# Altium project Multi_Interface_Hub_Pro_v1.0.PrjPcb (part 1 of 3)
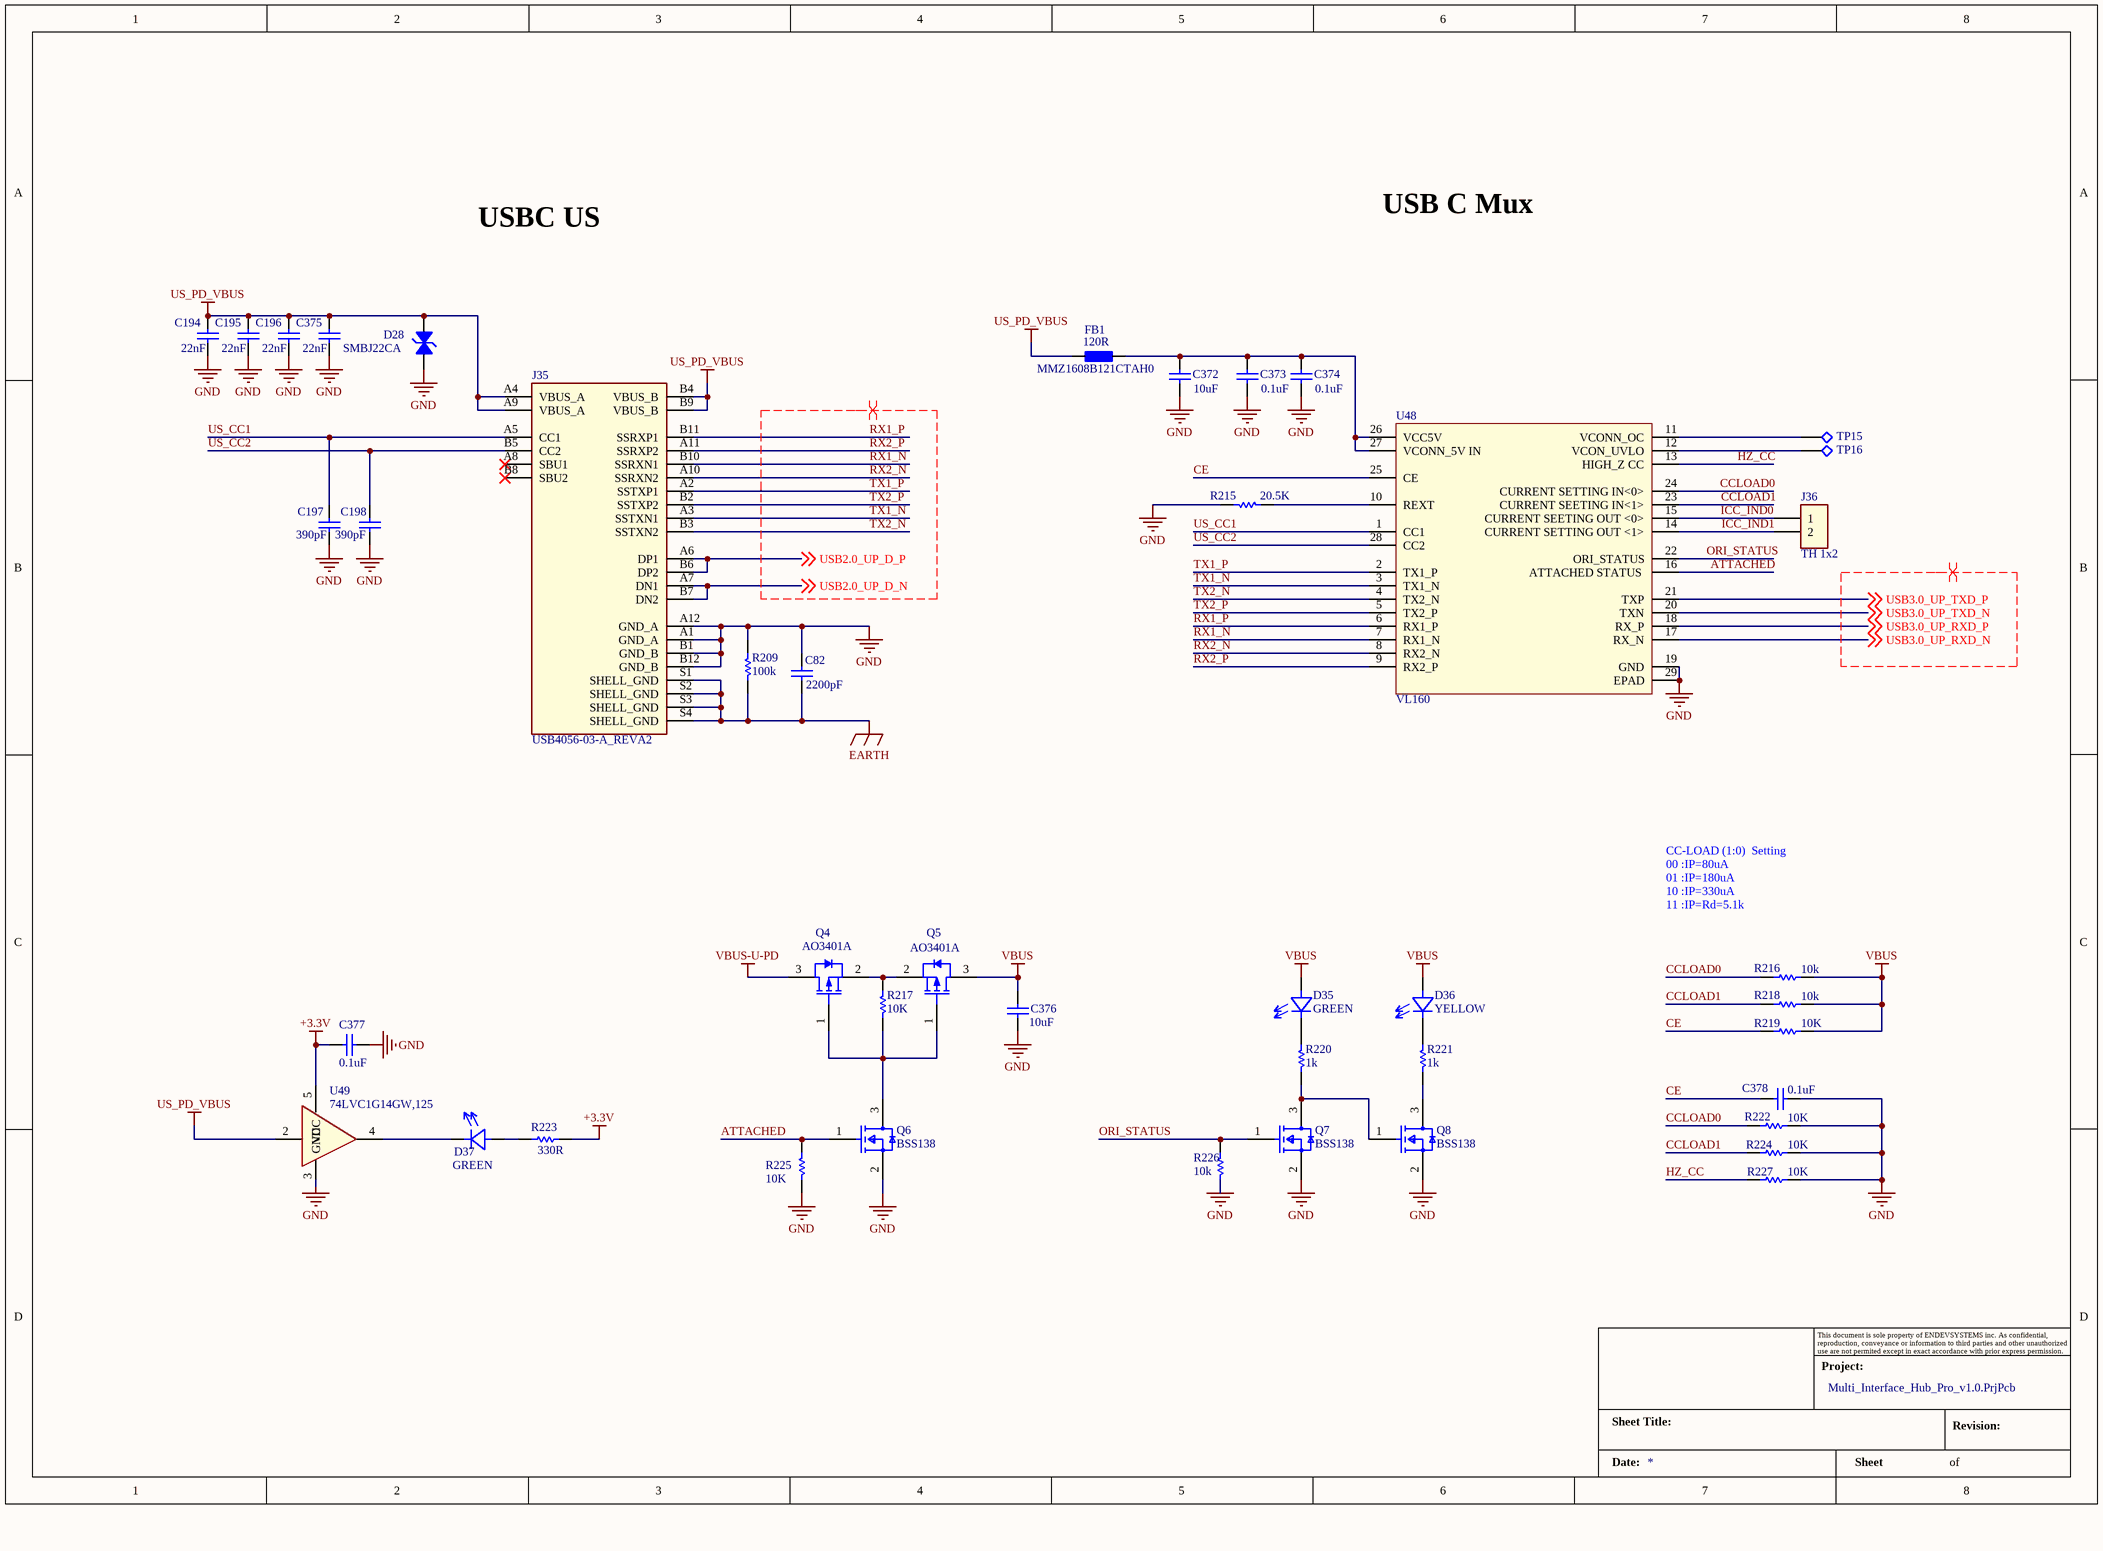
[diagram p0: USBC-US-Conn.SchDoc]
Revision: A
13 sheets, 788 parts. Net scope: global (net labels, ports and power ports of the same name join across sheets).
Board file: Multi_Interface_Hub_Pro_v1.0.PcbDoc
Sheets:
  USBC-US-Conn.SchDoc
  USBC-US-100W-PD.SchDoc
  USBC_Hub1.SchDoc
  USBC_Hub2.SchDoc
  USB2.0_Hub.SchDoc
  TypeA_3.1_Ports.SchDoc
  USBC_DS1_DS2.SchDoc
  USBC_DS3_DS4.SchDoc
  USBC-DS1-100W-PD.SchDoc
  PowerSwitch_DS2_DS3_DS4.SchDoc
  Gbe_Ethernet.SchDoc
  Audio_Codec.SchDoc
  InputPower.SchDoc

## Sheet USBC-US-Conn.SchDoc
size A3

### Parts
(Parts that share a designator on the sheet are numbered #1, #2 ... from top to bottom, then left to right.)
?#1  Project:: Multi_Interface_Hub_Pro_v1.0.PrjPcb  (hidden comment: Title_Block)  (graphical)
C82  2200pF  [C-0603/1608]
C194  22nF  [C-0805/2012]
C195  22nF  [C-0805/2012]
C196  22nF  [C-0805/2012]
C197  390pF  [C-0805/2012]
C198  390pF  [C-0805/2012]
C372  10uF  [C-0402/1005]
C373  0.1uF  [C-0402/1005]
C374  0.1uF  [C-0402/1005]
C375  22nF  [C-0805/2012]
C376  10uF  [C-0805/2012]
C377  0.1uF  [C-0402/1005]
C378  0.1uF  [C-0402/1005]
D28  SMBJ22CA  [DO-214AA\SMB]
D35  GREEN  [LEDC1608X65N]
D36  YELLOW  [LEDC1608X65N]
D37  GREEN  [LEDC1608X65N]
FB1  MMZ1608B121CTAH0  value 120R  [R-0603/1608]
J35  USB4056-03-A_REVA2  [GCT_USB4056-03-A_REVA2]
J36  TH 1x2  [PIN HEADER 1x2 2.54mm]
Q4  AO3401A  [AO-SOT-23-3L_V]
Q5  AO3401A  [AO-SOT-23-3L_V]
Q6  BSS138  [FP-318-08-IPC_B]
Q7  BSS138  [FP-318-08-IPC_B]
Q8  BSS138  [FP-318-08-IPC_B]
R209  100k  [R-0603/1608]
R215  20.5K  [R-0402/1005]
R216  10k  [R-0402/1005]
R217  10K  [R-0402/1005]
R218  10k  [R-0402/1005]
R219  10K  [R-0402/1005]
R220  1k  [R-0402/1005]
R221  1k  [R-0402/1005]
R222  10K  [R-0402/1005]
R223  330R  [R-0402/1005]
R224  10K  [R-0402/1005]
R225  10K  [R-0402/1005]
R226  10k  [R-0402/1005]
R227  10K  [R-0402/1005]
TP15  Test Points  [Test Point TH Round H0.9,D1.6]  (value not drawn)
TP16  Test Points  [Test Point TH Round H0.9,D1.6]  (value not drawn)
U48  VL160  [VL160]
U49  74LVC1G14GW,125  [SOT65P212X110-5N]

### Nets
+3.3V: C377.2 R223.2 U49.5(VCC)
EARTH: C82.1 J35.S1(SHELL_GND) J35.S2(SHELL_GND) J35.S3(SHELL_GND) J35.S4(SHELL_GND) R209.1
GND: C82.2 C194.1 C195.1 C196.1 C197.1 C198.1 C372.1 C373.1 C374.1 C375.1 C376.1 C377.1 C378.2 D28.1 J35.A1(GND_A) J35.A12(GND_A) J35.B1(GND_B) J35.B12(GND_B) Q6.2(S) Q7.2(S) Q8.2(S) R209.2 R215.1 R222.1 R224.1 R225.1 R226.1 R227.1 U48.19(GND) U48.29(EPAD) U49.3(GND)
US_PD_VBUS: C194.2 C195.2 C196.2 C375.2 D28.2 FB1.2 J35.A4(VBUS_A) J35.A9(VBUS_A) J35.B4(VBUS_B) J35.B9(VBUS_B) U49.2(A)
VBUS: C376.2 D35.A D36.A Q5.3(DRAIN) R216.1 R218.1 R219.1
VBUS-U-PD: Q4.3(DRAIN)
ATTACHED: Q6.1(G) R225.2 U48.16(ATTACHED_STATUS)
CCLOAD0: R216.2 R222.2 U48.24(CURRENT_SETTING_IN<0>)
CCLOAD1: R218.2 R224.2 U48.23(CURRENT_SEETING_IN<1>)
CE: C378.1 R219.2 U48.25(CE)
HZ_CC: R227.2 U48.13(HIGH_Z_CC)
ICC_IND0: J36.1 U48.15(CURRENT_SEETING_OUT_<0>)
ICC_IND1: J36.2 U48.14(CURRENT_SETTING_OUT_<1>)
ORI_STATUS: Q7.1(G) R226.2 U48.22(ORI_STATUS)
RX1_N: J35.B10(SSRXN1) U48.7(RX1_N)
RX1_P: J35.B11(SSRXP1) U48.6(RX1_P)
RX2_N: J35.A10(SSRXN2) U48.8(RX2_N)
RX2_P: J35.A11(SSRXP2) U48.9(RX2_P)
TX1_N: J35.A3(SSTXN1) U48.3(TX1_N)
TX1_P: J35.A2(SSTXP1) U48.2(TX1_P)
TX2_N: J35.B3(SSTXN2) U48.4(TX2_N)
TX2_P: J35.B2(SSTXP2) U48.5(TX2_P)
US_CC1: C197.2 J35.A5(CC1) U48.1(CC1)
US_CC2: C198.2 J35.B5(CC2) U48.28(CC2)
USB2.0_UP_D_N: J35.A7(DN1) J35.B7(DN2) ; off-sheet USB2.0_UP_D_N
USB2.0_UP_D_P: J35.A6(DP1) J35.B6(DP2) ; off-sheet USB2.0_UP_D_P
USB3.0_UP_RXD_N: U48.17(RX_N) ; off-sheet USB3.0_UP_RXD_N
USB3.0_UP_RXD_P: U48.18(RX_P) ; off-sheet USB3.0_UP_RXD_P
USB3.0_UP_TXD_N: U48.20(TXN) ; off-sheet USB3.0_UP_TXD_N
USB3.0_UP_TXD_P: U48.21(TXP) ; off-sheet USB3.0_UP_TXD_P
NetC372_2: C372.2 C373.2 C374.2 FB1.1 U48.26(VCC5V) U48.27(VCONN_5V_IN)
NetD35_C: D35.C R220.2
NetD36_C: D36.C R221.2
NetD37_A: D37.A R223.1
NetD37_C: D37.C U49.4(~{Y})
NetQ4_1: Q4.1(GATE) Q5.1(GATE) Q6.3(D) R217.1
NetQ4_2: Q4.2(SOURCE) Q5.2(SOURCE) R217.2
NetQ7_3: Q7.3(D) Q8.1(G) R220.1
NetQ8_3: Q8.3(D) R221.1
NetR215_2: R215.2 U48.10(REXT)
NetTP15_1: TP15.1 U48.11(VCONN_OC)
NetTP16_1: TP16.1 U48.12(VCON_UVLO)

Not connected (* = marked no-connect by the designer): J35 A8(SBU1)* B8(SBU2)*

### Layout directives
differential pair; differential pair class Diff_90R: RX1_N, RX1_P, RX2_N, RX2_P, TX1_N, TX1_P, TX2_N, TX2_P, USB2.0_UP_D_N, USB2.0_UP_D_P, USB3.0_UP_RXD_N, USB3.0_UP_RXD_P, USB3.0_UP_TXD_N, USB3.0_UP_TXD_P

### Notes on the sheet
- USBC US
- USB C Mux
- CC-LOAD (1:0)  Setting
  00 :IP=80uA
  01 :IP=180uA
  10 :IP=330uA
  11 :IP=Rd=5.1k
- (in symbol Title_Block) This document is sole property of ENDEVSYSTEMS inc. As confidential, reproduction, conveyance or information to third parties and other unauthorized use are not permited except in exact accordance with prior express permission.; Project:; Sheet Title:; Revision:; Date:; Sheet; of

### Library data of the parts
C82 C194-C198 C372 C375 C376 = Cap: Capacitor; Value: 0.1uF; Published: 8-Jun-2000; LatestRevisionDate: 17-Jul-2002; LatestRevisionNote: Re-released for DXP Platform.; PackageReference: RAD-0.3; Publisher: Altium Limited; PackageDescription: Radial Cap, Thru-Hole; 2 Leads; 0.3 in Pin Spacing
C373 C374 C377 C378 = Cap: Capacitor; Published: 8-Jun-2000; LatestRevisionDate: 17-Jul-2002; LatestRevisionNote: Re-released for DXP Platform.; PackageReference: RAD-0.3; Publisher: Altium Limited; PackageDescription: Radial Cap, Thru-Hole; 2 Leads; 0.3 in Pin Spacing; Value: 0.1uF
D28 = ACPDQC3V3T-HF: TVS DIODE 3.3V 9.8V 0402C; Unit Price (USD): 0.41; Mfr. Part No.: ACPDQC3V3T-HF; Supplier Part No.: 641-1635-1-ND; Supplier: Digikey Electronics
D35-D37 = Diode-LED: Supplier: Digikey Electronics
FB1 = BLM15H: FERRITE BEAD 120 OHM 0402 1LN; Mfr. Part No.: BLM15HB121SN1D; Unit Price (USD): 0.19; Supplier Part No.: 490-4000-1-ND; Supplier: Digikey Electronics
J35 = USB4056-03-A_REVA2: USB-C (USB TYPE-C) USB 3.2 Gen 2 (USB 3.1 Gen 2, Superspeed + (USB 3.1)) Receptacle Connector 24 Position Surface Mount, Right Angle; Through Hole; MF: Global Connector Technology; Package: None; Check_prices: https://www.snapeda.com/parts/USB4056-03-A/Global+Connector+Technology/view-part/?ref=eda; Value: *; Availability: In Stock; SnapEDA_Link: https://www.snapeda.com/parts/USB4056-03-A/Global+Connector+Technology/view-part/?ref=snap; MP: USB4056-03-A; Price: None
J36 = Header 1x2: CONN HEADER VERT 3POS 2.54MM; Mfr. Part No.: 75160-156-03LF; Value: 51R; Unit Price (USD): 0.74; Supplier Part No.: 609-75160-156-03LF-ND; Supplier: Digikey Electronics
Q4 Q5 = CMP-2000-05778-1: P-Channel MOSFET, 30 V, 4 A, -55 to 150 degC, 3-Pin SOT-23-3L, RoHS, Tape and Reel; Manufacturer: Alpha and Omega; Output Power (Max): NotRequiredW; Power Dissipation: 1.4W; Rad Hardened: No; Drain Efficiency: NotRequired%; Drain-Source On-Volt: 30V; Noise Figure: NotRequireddB; Frequency (Max): NotRequiredMHz; Number of  Elements: 1; Gate-Source Voltage (Max): ?12V; Drain Current (Max): 4A; Channel Mode: Enhancement; Drain-Source On-Res: 0.044ohm; Type: PowerMOSFET; Polarity: P; Package URL: http://www.aosmd.com/res/packaging_information/SOT-23-3L.pdf; Datasheet URL: http://www.aosmd.com/res/data_sheets/AO3401A.pdf; Package Type: SOT-23; Package Description: 3-Pin Small Outline Transistor, Body 2.95 x 1.6 mm, Pitch 0.95 mm; Mounting: SurfaceMount; Manufacturer URL: http://www.aosmd.com/; Continuous Drain Current: 4A; Package Reference: SOT-23-3L; Mounting Technology: SurfaceMount; Operating Temperature Classification: Military; Power Gain: NotRequireddB; Datasheet Version: Rev. 3, 03/2011; Operating Temp Range: -55Cto150C; Pin Count: 3
Q6-Q8 = CMP-07173-000101-1: MOSFET N-CH 50V 220MA SOT-23; Turn-Off Delay Time: 20ns; Element Configuration: Single; Rds On Max: 3.5R; Gate to Source Voltage (Vgs): 20V; Threshold Voltage: 1.3V; Number of Elements: 1; Power Dissipation: 360mW; Rise Time: 9ns; Turn-On Delay Time: 2.5ns; Input Capacitance: 27pF; On-State Resistance: 6R; Lead Free: Lead Free; Length: 2.92mm; Width: 1.3mm; Drain to Source Breakdown Voltage: 50V; Min Operating Temperature: -55°C; REACH SVHC: No SVHC; Packaging: Tape and Reel; Radiation Hardening: No; Height: 0.93mm; Drain to Source Voltage (Vdss): 50V; Current Rating: 220mA; Voltage Rating (DC): 50V; Weight: 0.03g; Continuous Drain Current (ID): 220mA; Number of Pins: 3; Nominal Vgs: 1.3V; Max Power Dissipation: 360mW; Fall Time: 9ns; Drain to Source Resistance: 3.5R; Contact Plating: Tin; Case/Package: SOT-23; Package Quantity: 1; Dual Supply Voltage: 50V; Mount: Surface Mount; Termination: SMD/SMT; Max Operating Temperature: 150°C
R209 R215 R220 R221 R223 = Res1: Resistor; Value: 10K; Published: 8-Jun-2000; LatestRevisionDate: 17-Jul-2002; LatestRevisionNote: Re-released for DXP Platform.; PackageReference: AXIAL-0.3; Publisher: Altium Limited; PackageDescription: Axial Device, Thru-Hole; 2 Leads; 0.3 in Pin Spacing
R216-R219 R222 R224-R227 = Res1: Resistor; Published: 8-Jun-2000; LatestRevisionDate: 17-Jul-2002; LatestRevisionNote: Re-released for DXP Platform.; PackageReference: AXIAL-0.3; Publisher: Altium Limited; PackageDescription: Axial Device, Thru-Hole; 2 Leads; 0.3 in Pin Spacing; Value: 10K
U49 = 74LVC1G14GW,125: Inverter Schmitt Trigger 1-Element CMOS 5-Pin TSSOP T/R; Price: None; Availability: Unavailable; MP: 74LVC1G14GW,125; Value: *; Package: None
?#1 = Title_Block: Date:: *

## Sheet USBC-US-100W-PD.SchDoc
size A3; SheetNumber: 1; SheetTotal: 4
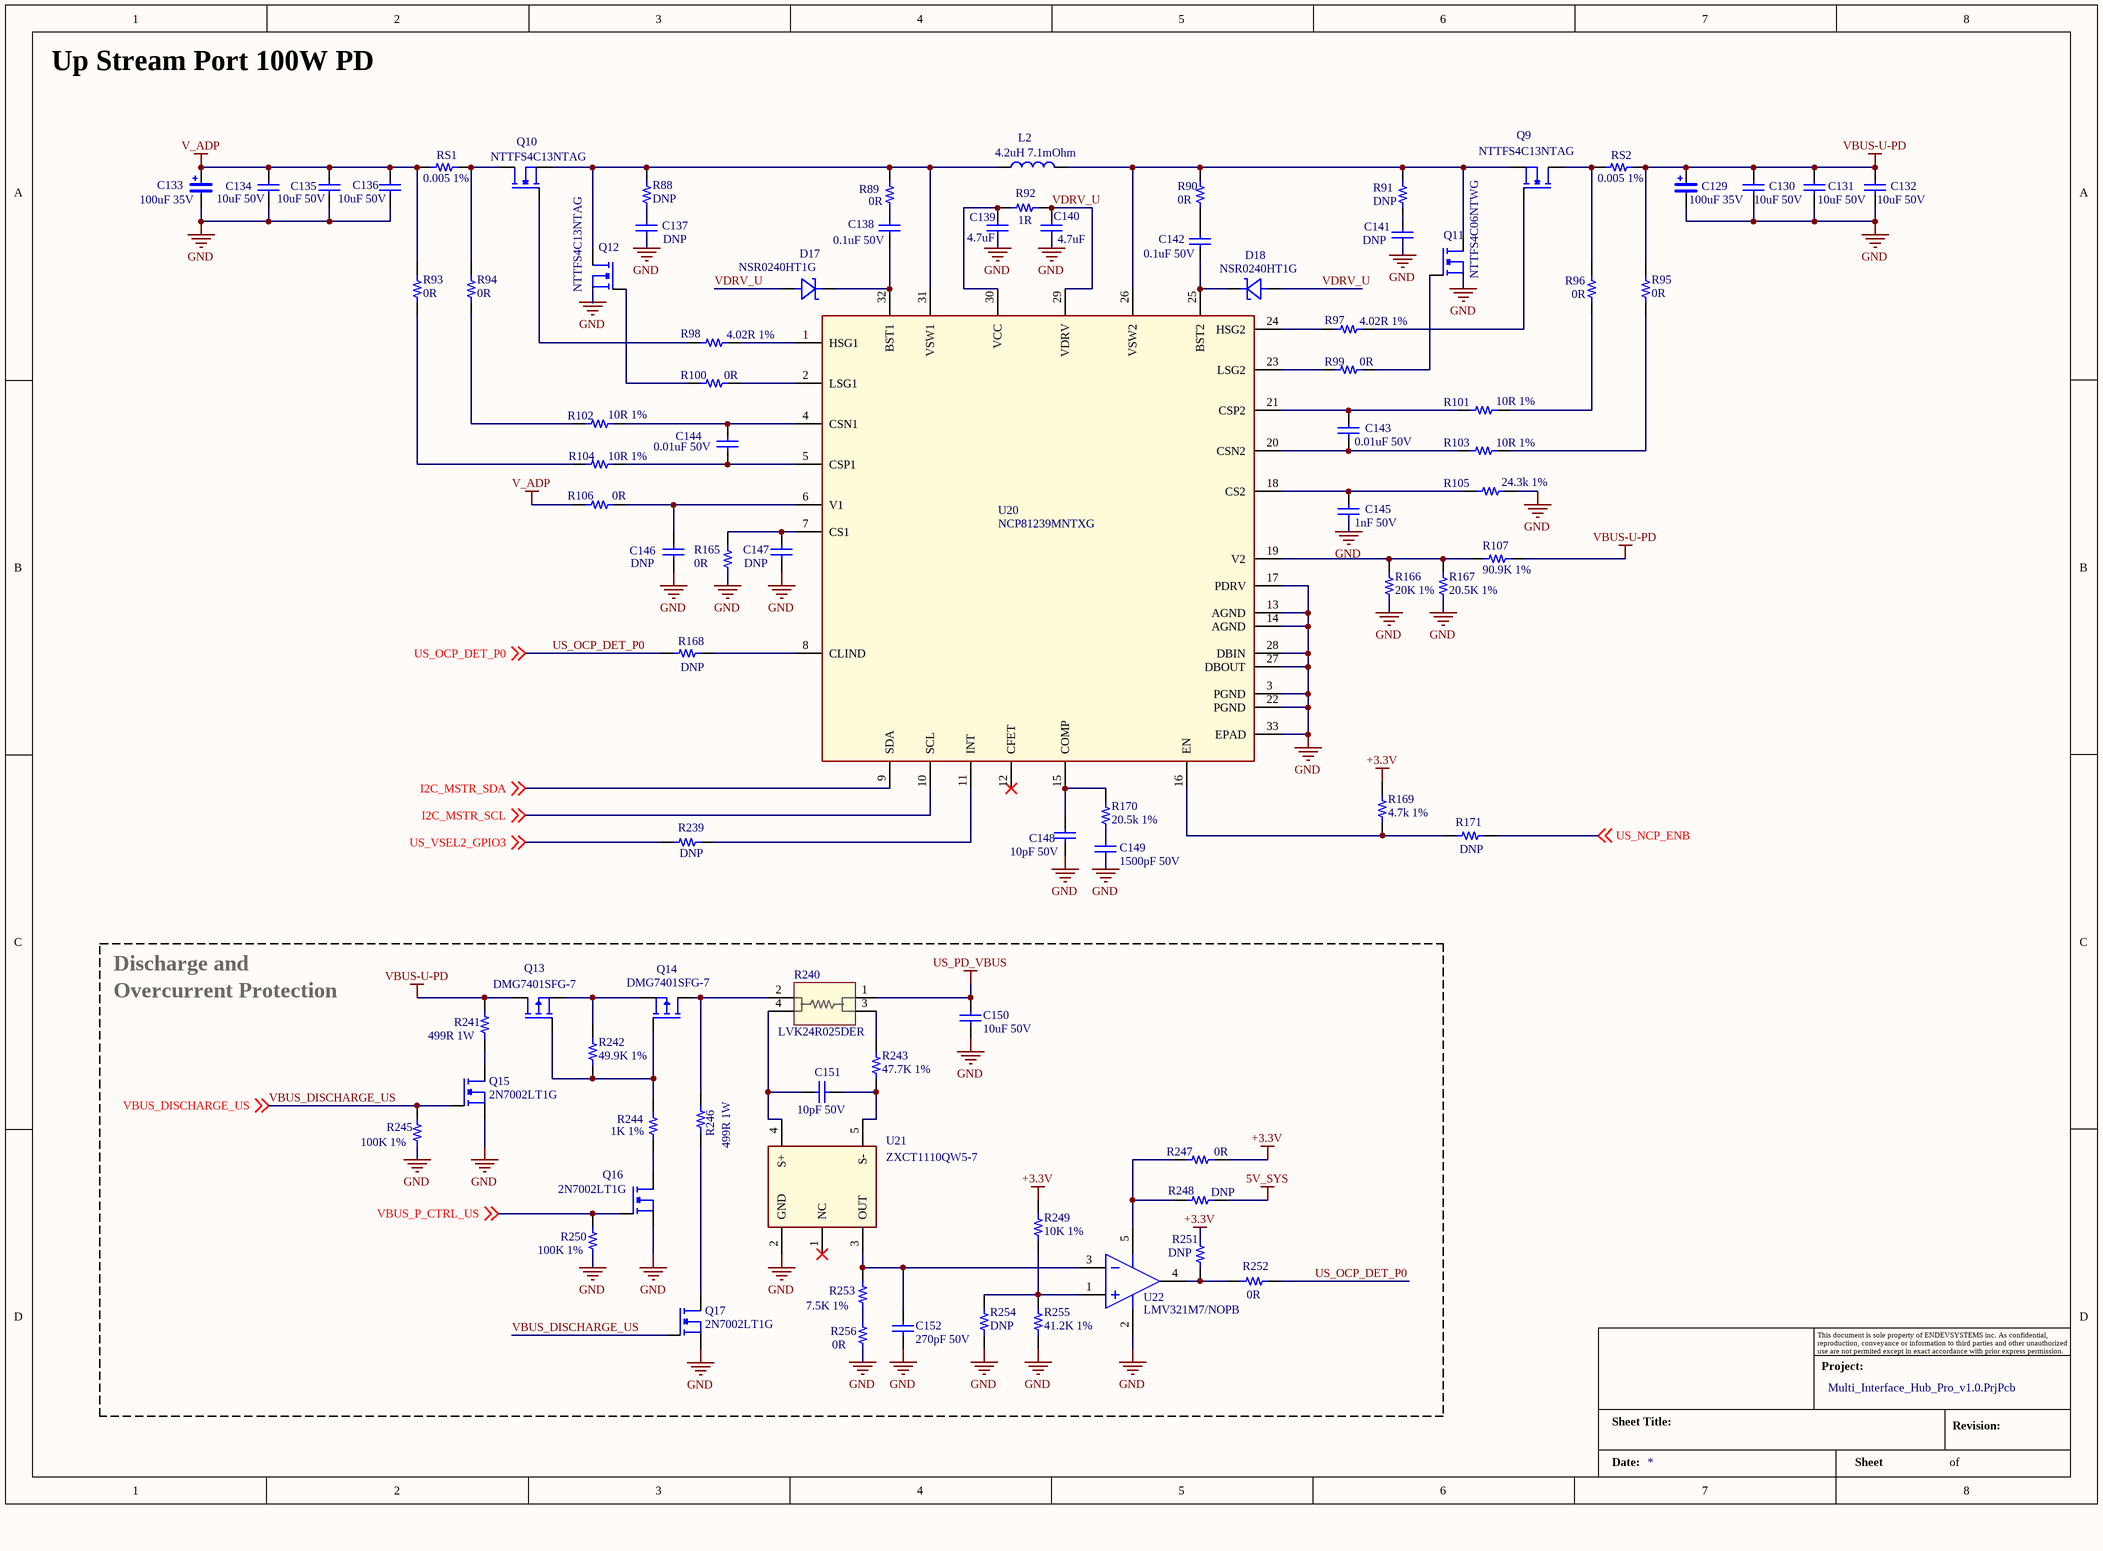
[diagram p1: USBC-US-100W-PD.SchDoc]

### Parts
(Parts that share a designator on the sheet are numbered #1, #2 ... from top to bottom, then left to right.)
?#2  Project:: Multi_Interface_Hub_Pro_v1.0.PrjPcb  (hidden comment: Title_Block)  (graphical)
C129  100uF 35V  [C-1206 (Tantalum)]
C130  10uF 50V  [C-0402/1005]
C131  10uF 50V  [C-0402/1005]
C132  10uF 50V  [C-0402/1005]
C133  100uF 35V  [C-1206 (Tantalum)]
C134  10uF 50V  [C-0402/1005]
C135  10uF 50V  [C-0402/1005]
C136  10uF 50V  [C-0402/1005]
C137  DNP  [C-0402/1005]
C138  0.1uF 50V  [C-0402/1005]
C139  4.7uF  [C-0402/1005]
C140  4.7uF  [C-0402/1005]
C141  DNP  [C-0402/1005]
C142  0.1uF 50V  [C-0402/1005]
C143  0.01uF 50V  [C-0402/1005]
C144  0.01uF 50V  [C-0402/1005]
C145  1nF 50V  [C-0402/1005]
C146  DNP  [C-0402/1005]
C147  DNP  [C-0402/1005]
C148  10pF 50V  [C-0402/1005]
C149  1500pF 50V  [C-0402/1005]
C150  value 10uF 50V  [C-0402/1005]  (hidden comment: 0.1uF)
C151  value 10pF 50V  [C-0402/1005]  (hidden comment: 0.1uF)
C152  value 270pF 50V  [C-0402/1005]  (hidden comment: 0.1uF)
D17  NSR0240HT1G  [SOIC-8 (W3.9mm) B]
D18  NSR0240HT1G  [SOIC-8 (W3.9mm) B]
L2  4.2uH 7.1mOhm  [4.3x4.3mm]
Q9  NTTFS4C13NTAG
Q10  NTTFS4C13NTAG
Q11  NTTFS4C06NTWG
Q12  NTTFS4C13NTAG
Q13  DMG7401SFG-7
Q14  DMG7401SFG-7
Q15  2N7002LT1G
Q16  2N7002LT1G
Q17  2N7002LT1G
R88  DNP  [R-0402]
R89  0R  [R-0402]
R90  0R  [R-0402]
R91  DNP  [R-0402]
R92  1R  [R-0402]
R93  0R  [R-0402]
R94  0R  [R-0402]
R95  0R  [R-0402]
R96  0R  [R-0402]
R97  4.02R 1%  [R-0402]
R98  4.02R 1%  [R-0402]
R99  0R  [R-0402]
R100  0R  [R-0402]
R101  10R 1%  [R-0402]
R102  10R 1%  [R-0402]
R103  10R 1%  [R-0402]
R104  10R 1%  [R-0402]
R105  24.3k 1%  [R-0402]
R106  0R  [R-0402]
R107  90.9K 1%  [R-0402]
R165  0R  [R-0402]
R166  20K 1%  [R-0402]
R167  20.5K 1%  [R-0402]
R168  DNP  [R-0402]
R169  4.7k 1%  [R-0402]
R170  20.5k 1%  [R-0402]
R171  DNP  [R-0402]
R239  DNP  [R-0402]
R240  LVK24R025DER  [LVK24_OHM]
R241  499R 1W  [R-0402]
R242  49.9K 1%  [R-0402]
R243  47.7K 1%  [R-0402]
R244  1K 1%  [R-0402]
R245  100K 1%  [R-0402]
R246  499R 1W  [R-0402]
R247  0R  [R-0402]
R248  DNP  [R-0402]
R249  10K 1%  [R-0402]
R250  100K 1%  [R-0402]
R251  DNP  [R-0402]
R252  0R  [R-0402]
R253  7.5K 1%  [R-0402]
R254  DNP  [R-0402]
R255  41.2K 1%  [R-0402]
R256  0R  [R-0402]
RS1  0.005 1%  [R-0402]
RS2  0.005 1%  [R-0402]
U20  NCP81239MNTXG  [QFN32_5X5_ONS]
U21  ZXCT1110QW5-7  [MSOP-10-W3mm]
U22  LMV321M7/NOPB  [DCK0005A_M]

### Nets
5V_SYS: R248.1
+3.3V: R169.1 R247.1 R249.2 R251.2
GND: C129.- C130.1 C131.1 C132.1 C133.- C134.1 C135.1 C136.1 C137.1 C139.1 C140.1 C141.1 C145.1 C146.1 C147.1 C148.1 C149.1 C150.2 C152.2 Q11.2(S) Q12.2(S) Q15.2(S) Q16.2(S) Q17.2(S) R105.2 R165.2 R166.2 R167.2 R245.1 R250.1 R254.1 R255.1 R256.1 U20.3(PGND) U20.13(AGND) U20.14(AGND) U20.17(PDRV) U20.22(PGND) U20.27(DBOUT) U20.28(DBIN) U20.33(EPAD) U21.2(GND) U22.2(V-)
US_PD_VBUS: C150.1 R240.1(E1)
V_ADP: C133.+ C134.2 C135.2 C136.2 R93.1 R106.2 RS1.1
VBUS-U-PD: C129.+ C130.2 C131.2 C132.2 Q13.3 R95.2 R107.2 R241.2 RS2.2
I2C_MSTR_SCL: U20.10(SCL) ; off-sheet I2C_MSTR_SCL
I2C_MSTR_SDA: U20.9(SDA) ; off-sheet I2C_MSTR_SDA
US_NCP_ENB: R171.2 ; off-sheet US_NCP_ENB
US_OCP_DET_P0: R168.2 R252.1 ; off-sheet US_OCP_DET_P0
US_VSEL2_GPIO3: R239.2 ; off-sheet US_VSEL2_GPIO3
VBUS_DISCHARGE_US: Q15.1(G) Q17.1(G) R245.2 ; off-sheet VBUS_DISCHARGE_US
VBUS_P_CTRL_US: Q16.1(G) R250.2 ; off-sheet VBUS_P_CTRL_US
VDRV_U: C140.2 D17.A D18.A R92.1 U20.29(VDRV)
NetC137_2: C137.2 R88.1
NetC138_1: C138.1 D17.C U20.32(BST1)
NetC138_2: C138.2 R89.1
NetC139_2: C139.2 R92.2 U20.30(VCC)
NetC141_2: C141.2 R91.1
NetC142_1: C142.1 D18.C U20.25(BST2)
NetC142_2: C142.2 R90.1
NetC143_1: C143.1 R103.2 U20.20(CSN2)
NetC143_2: C143.2 R101.2 U20.21(CSP2)
NetC144_1: C144.1 R104.1 U20.5(CSP1)
NetC144_2: C144.2 R102.1 U20.4(CSN1)
NetC145_2: C145.2 R105.1 U20.18(CS2)
NetC146_2: C146.2 R106.1 U20.6(V1)
NetC147_2: C147.2 R165.1 U20.7(CS1)
NetC148_2: C148.2 R170.1 U20.15(COMP)
NetC149_2: C149.2 R170.2
NetC151_1: C151.1 R243.1 U21.5(S-)
NetC151_2: C151.2 R240.4 U21.4(S+)
NetC152_1: C152.1 R253.2 U21.3(OUT) U22.3(IN-)
NetL2_1: L2.1 Q10.2(S) Q12.3(D) R88.2 R89.2 U20.31(VSW1)
NetL2_2: L2.2 Q9.2(S) Q11.3(D) R90.2 R91.2 U20.26(VSW2)
NetQ9_1: Q9.1(G) R97.1
NetQ9_3: Q9.3(D) R96.2 RS2.1
NetQ10_1: Q10.1(G) R98.2
NetQ10_3: Q10.3(D) R94.1 RS1.2
NetQ11_1: Q11.1(G) R99.1
NetQ12_1: Q12.1(G) R100.2
NetQ13_1: Q13.1 Q14.1 R242.1 R244.2
NetQ13_2: Q13.2 Q14.2 R242.2
NetQ14_3: Q14.3 R240.2(E2) R246.2
NetQ15_3: Q15.3(D) R241.1
NetQ16_3: Q16.3(D) R244.1
NetQ17_3: Q17.3(D) R246.1
NetR93_2: R93.2 R104.2
NetR94_2: R94.2 R102.2
NetR95_1: R95.1 R103.1
NetR96_1: R96.1 R101.1
NetR97_2: R97.2 U20.24(HSG2)
NetR98_1: R98.1 U20.1(HSG1)
NetR99_2: R99.2 U20.23(LSG2)
NetR100_1: R100.1 U20.2(LSG1)
NetR107_1: R107.1 R166.1 R167.1 U20.19(V2)
NetR168_1: R168.1 U20.8(CLIND)
NetR169_2: R169.2 R171.1 U20.16(EN)
NetR239_1: R239.1 U20.11(INT)
NetR240_3: R240.3 R243.2
NetR247_2: R247.2 R248.2 U22.5(V+)
NetR249_1: R249.1 R254.2 R255.2 U22.1(IN+)
NetR251_1: R251.1 R252.2 U22.4(OUT)
NetR253_1: R253.1 R256.2

Not connected (* = marked no-connect by the designer): U20 12(CFET)*; U21 1(NC)*

### Notes on the sheet
- Up Stream Port 100W PD
- Discharge and
- Overcurrent Protection
- (in symbol Title_Block) This document is sole property of ENDEVSYSTEMS inc. As confidential, reproduction, conveyance or information to third parties and other unauthorized use are not permited except in exact accordance with prior express permission.; Project:; Sheet Title:; Revision:; Date:; Sheet; of

### Library data of the parts
C129 C133 = Capacitor-Polar: CAP TANT 10UF 10% 16V 1206; Mfr. Part No.: F931C106KAAAJ6; Unit Price (USD): 0.67; Value: 10uF 16V; Supplier Part No.: 478-10723-1-ND; Supplier: Digikey Electronics
C130-C132 C134-C137 C139-C141 C143-C149 = Cap: Capacitor; Value: 0.1uF; Published: 8-Jun-2000; LatestRevisionDate: 17-Jul-2002; LatestRevisionNote: Re-released for DXP Platform.; PackageReference: RAD-0.3; Publisher: Altium Limited; PackageDescription: Radial Cap, Thru-Hole; 2 Leads; 0.3 in Pin Spacing
C138 C142 C150-C152 = Cap: Capacitor; Published: 8-Jun-2000; LatestRevisionDate: 17-Jul-2002; LatestRevisionNote: Re-released for DXP Platform.; PackageReference: RAD-0.3; Publisher: Altium Limited; PackageDescription: Radial Cap, Thru-Hole; 2 Leads; 0.3 in Pin Spacing
  C138 C142: Value: 0.1uF
D17 D18 = Diode-Schottky: Supplier: Digikey Electronics
L2 = 4.3x4.3mm: FIXED IND 22UH 620MA 350 MOHM; Mfr. Part No.: ASPI-4020S-220M-T; Unit Price (USD): 0.48; Supplier Part No.: 535-12307-1-ND; Value: 22uH; Supplier: Digikey Electronics
Q9-Q12 Q15-Q17 = MOSFET-N: Supplier: Digikey Electronics
Q13 Q14 = MOSFET-P: Supplier: Digikey Electronics
R88-R107 R165-R171 R239 R241-R256 RS1 RS2 = Resistor: RES SMD 51 OHM 0.5% 1/16W 0402; Mfr. Part No.: ERA-2AED510X; Value: 51R; Unit Price (USD): 0.21; Supplier Part No.: P51DECT-ND; Supplier: Digikey Electronics
R240 = LVK24R025DER: No Description Available; Mfr_Name: Ohmite; RefDes: RefDes; Type: Type
U20 = NCP81239MNTXG: No Description Available; Mfr_Name: onsemi; RefDes: RefDes; Type: Type
U21 = LT8607EMSE#PBF: IC REG BUCK ADJ 750MA 8DFN; Mfr. Part No.: LT8607EDC#TRMPBF; Unit Price (USD): 5.48; Supplier: Digikey Electronics; Supplier Part No.: LT8607EMSE#PBF-ND
U22 = CMP-0055-01046-3: General Purpose, Low Voltage, Rail-to-Rail Output Operational Amplifiers, 5-pin SC-70, Pb-Free; Manufacturer: Texas Instruments; PackageTopMarking: A12*XTT; PowerWise: N; CompType: Amplifiers; ComponentLink1Description: Datasheet URL; Code_JEITA: SC-88A; ComponentLink1URL: http://www.ti.com/general/docs/lit/getliterature.tsp?genericPartNumber=LMV321-N&fileType=pdf; Code_IPC: SOT353-5; PinCount: 5; RoHS: Y; Code_JEDEC: MO-203-AA; PackageDescription: Molded SC-70, 2 x 1.25 x .9mm, 5 Lead, 0.65mm Pitch; Package Reference: DCK0005A
?#2 = Title_Block: Date:: *

## Sheet USBC_Hub1.SchDoc
size A3; SheetNumber: 1; SheetTotal: 4
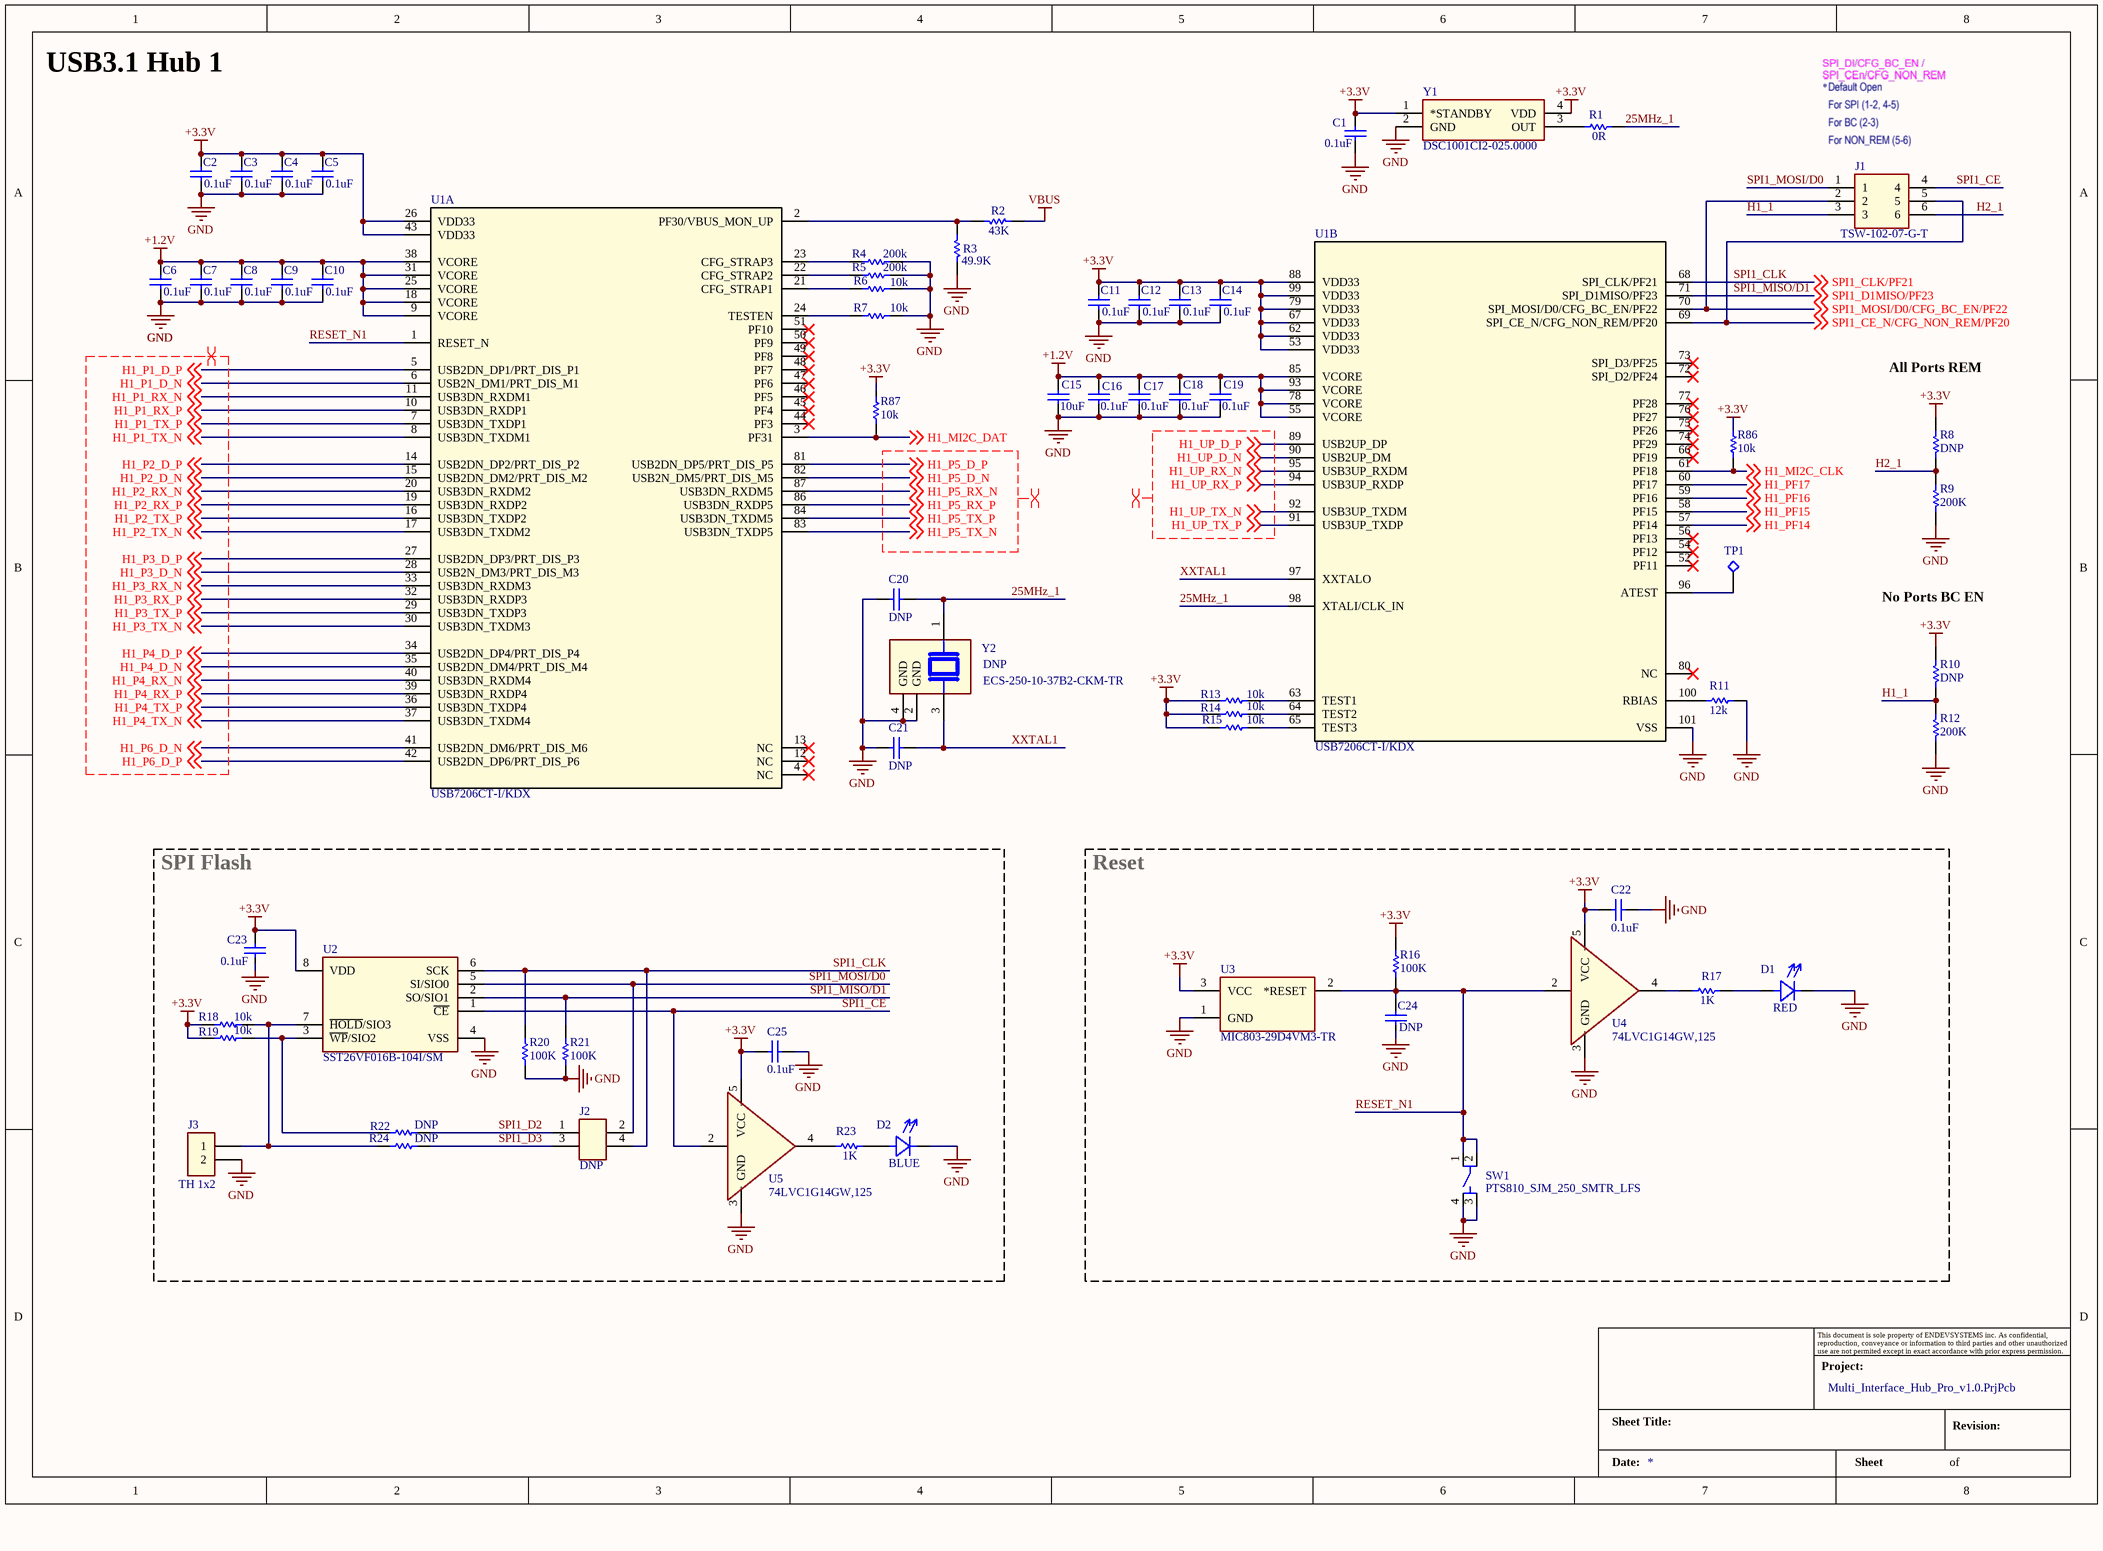
[diagram p2: USBC_Hub1.SchDoc]

### Parts
(Parts that share a designator on the sheet are numbered #1, #2 ... from top to bottom, then left to right.)
?#3  Project:: Multi_Interface_Hub_Pro_v1.0.PrjPcb  (hidden comment: Title_Block)  (graphical)
C1  0.1uF  [C-0402/1005]
C2  0.1uF  [C-0402/1005]
C3  0.1uF  [C-0402/1005]
C4  0.1uF  [C-0402/1005]
C5  0.1uF  [C-0402/1005]
C6  0.1uF  [C-0402/1005]
C7  0.1uF  [C-0402/1005]
C8  0.1uF  [C-0402/1005]
C9  0.1uF  [C-0402/1005]
C10  0.1uF  [C-0402/1005]
C11  0.1uF  [C-0402/1005]
C12  0.1uF  [C-0402/1005]
C13  0.1uF  [C-0402/1005]
C14  0.1uF  [C-0402/1005]
C15  10uF  [C-0805/2012]
C16  0.1uF  [C-0402/1005]
C17  0.1uF  [C-0402/1005]
C18  0.1uF  [C-0402/1005]
C19  0.1uF  [C-0402/1005]
C20  DNP  [R-0402/1005]
C21  DNP  [R-0402/1005]
C22  0.1uF  [C-0402/1005]
C23  0.1uF  [C-0402/1005]
C24  value DNP  [C-0402/1005]  (hidden comment: 0.1uF)
C25  0.1uF  [C-0402/1005]
D1  RED  [LEDC1608X65N]
D2  BLUE  [LEDC1608X65N]
J1  TSW-102-07-G-T  [CON6_3X2_TU_TSW_SAI]
J2  DNP  [PIN HEADER 2x2 2.54mm]
J3  TH 1x2  [PIN HEADER 1x2 2.54mm]
R1  0R  [R-0402/1005]
R2  43K  [R-0402/1005]
R3  49.9K  [R-0402/1005]
R4  200k  [R-0402/1005]
R5  200k  [R-0402/1005]
R6  10k  [R-0402/1005]
R7  10k  [R-0402/1005]
R8  DNP  [R-0402/1005]
R9  200K  [R-0402/1005]
R10  DNP  [R-0402/1005]
R11  12k  [R-0402/1005]
R12  200K  [R-0402/1005]
R13  10k  [R-0402/1005]
R14  10k  [R-0402/1005]
R15  10k  [R-0402/1005]
R16  100K  [R-0402/1005]
R17  1K  [R-0402/1005]
R18  10k  [R-0402/1005]
R19  10k  [R-0402/1005]
R20  100K  [R-0402/1005]
R21  100K  [R-0402/1005]
R22  DNP  [R-0402/1005]
R23  1K  [R-0402/1005]
R24  DNP  [R-0402/1005]
R86  10k  [R-0402/1005]
R87  10k  [R-0402/1005]
SW1  PTS810_SJM_250_SMTR_LFS  [SW_PTS810_SJM_250_SMTR_LFS]
TP1  Test Points  [Test Point TH Round H0.9,D1.6]  (value not drawn)
U1  USB7206CT-I/KDX  [USB7206]  (parts A,B of 2)
U2  SST26VF016B-104I/SM  [SOIC127P794X203-8N]
U3  MIC803-29D4VM3-TR  [SOT-23_M3_MCH]
U4  74LVC1G14GW,125  [SOT65P212X110-5N]
U5  74LVC1G14GW,125  [SOT65P212X110-5N]
Y1  DSC1001CI2-025.0000  [CDFN4_3P2X2P5_MCH]
Y2  DNP  [ECS-250-10-37B2]

### Blocks framed on the sheet
SPI Flash: C23 C25 D2 J2 J3 R18-R24 U2 U5
Reset: C22 C24 D1 R16 R17 SW1 U3 U4

### Nets
+1.2V: C6.2 C7.2 C8.2 C9.2 C10.2 C15.2 C16.1 C17.1 C18.2 C19.2 U1.9(VCORE) U1.18(VCORE) U1.25(VCORE) U1.31(VCORE) U1.38(VCORE) U1.55(VCORE) U1.78(VCORE) U1.85(VCORE) U1.93(VCORE)
+3.3V: C1.2 C2.2 C3.2 C4.2 C5.2 C11.2 C12.2 C13.2 C14.2 C22.2 C23.2 C25.2 R8.2 R10.2 R13.2 R14.2 R15.2 R16.1 R18.2 R19.2 R86.1 R87.1 U1.26(VDD33) U1.43(VDD33) U1.53(VDD33) U1.62(VDD33) U1.67(VDD33) U1.79(VDD33) U1.88(VDD33) U1.99(VDD33) U2.8(VDD) U3.3(VCC) U4.5(VCC) U5.5(VCC) Y1.1(*STANDBY) Y1.4(VDD)
GND: C1.1 C2.1 C3.1 C4.1 C5.1 C6.1 C7.1 C8.1 C9.1 C10.1 C11.1 C12.1 C13.1 C14.1 C15.1 C16.2 C17.2 C18.1 C19.1 C20.2 C21.2 C22.1 C23.1 C24.1 C25.1 D1.C D2.C J3.2 R3.2 R4.2 R5.2 R6.2 R7.1 R9.1 R11.1 R12.1 R20.2 R21.2 SW1.3 SW1.4 U1.101(VSS) U2.4(VSS) U3.1(GND) U4.3(GND) U5.3(GND) Y1.2(GND) Y2.2(GND) Y2.4(GND)
VBUS: R2.2
25MHz_1: C20.1 R1.2 U1.98(XTALI/CLK_IN) Y2.1
H1_1: J1.3 R10.1 R12.2
H1_MI2C_CLK: R86.2 U1.61(PF18) ; off-sheet H1_MI2C_CLK
H1_MI2C_DAT: R87.2 U1.3(PF31) ; off-sheet H1_MI2C_DAT
H1_P1_D_N: U1.6(USB2N_DM1/PRT_DIS_M1) ; off-sheet H1_P1_D_N
H1_P1_D_P: U1.5(USB2DN_DP1/PRT_DIS_P1) ; off-sheet H1_P1_D_P
H1_P1_RX_N: U1.11(USB3DN_RXDM1) ; off-sheet H1_P1_RX_N
H1_P1_RX_P: U1.10(USB3DN_RXDP1) ; off-sheet H1_P1_RX_P
H1_P1_TX_N: U1.8(USB3DN_TXDM1) ; off-sheet H1_P1_TX_N
H1_P1_TX_P: U1.7(USB3DN_TXDP1) ; off-sheet H1_P1_TX_P
H1_P2_D_N: U1.15(USB2DN_DM2/PRT_DIS_M2) ; off-sheet H1_P2_D_N
H1_P2_D_P: U1.14(USB2DN_DP2/PRT_DIS_P2) ; off-sheet H1_P2_D_P
H1_P2_RX_N: U1.20(USB3DN_RXDM2) ; off-sheet H1_P2_RX_N
H1_P2_RX_P: U1.19(USB3DN_RXDP2) ; off-sheet H1_P2_RX_P
H1_P2_TX_N: U1.17(USB3DN_TXDM2) ; off-sheet H1_P2_TX_N
H1_P2_TX_P: U1.16(USB3DN_TXDP2) ; off-sheet H1_P2_TX_P
H1_P3_D_N: U1.28(USB2N_DM3/PRT_DIS_M3) ; off-sheet H1_P3_D_N
H1_P3_D_P: U1.27(USB2DN_DP3/PRT_DIS_P3) ; off-sheet H1_P3_D_P
H1_P3_RX_N: U1.33(USB3DN_RXDM3) ; off-sheet H1_P3_RX_N
H1_P3_RX_P: U1.32(USB3DN_RXDP3) ; off-sheet H1_P3_RX_P
H1_P3_TX_N: U1.30(USB3DN_TXDM3) ; off-sheet H1_P3_TX_N
H1_P3_TX_P: U1.29(USB3DN_TXDP3) ; off-sheet H1_P3_TX_P
H1_P4_D_N: U1.35(USB2DN_DM4/PRT_DIS_M4) ; off-sheet H1_P4_D_N
H1_P4_D_P: U1.34(USB2DN_DP4/PRT_DIS_P4) ; off-sheet H1_P4_D_P
H1_P4_RX_N: U1.40(USB3DN_RXDM4) ; off-sheet H1_P4_RX_N
H1_P4_RX_P: U1.39(USB3DN_RXDP4) ; off-sheet H1_P4_RX_P
H1_P4_TX_N: U1.37(USB3DN_TXDM4) ; off-sheet H1_P4_TX_N
H1_P4_TX_P: U1.36(USB3DN_TXDP4) ; off-sheet H1_P4_TX_P
H1_P5_D_N: U1.82(USB2N_DM5/PRT_DIS_M5) ; off-sheet H1_P5_D_N
H1_P5_D_P: U1.81(USB2DN_DP5/PRT_DIS_P5) ; off-sheet H1_P5_D_P
H1_P5_RX_N: U1.87(USB3DN_RXDM5) ; off-sheet H1_P5_RX_N
H1_P5_RX_P: U1.86(USB3DN_RXDP5) ; off-sheet H1_P5_RX_P
H1_P5_TX_N: U1.83(USB3DN_TXDP5) ; off-sheet H1_P5_TX_N
H1_P5_TX_P: U1.84(USB3DN_TXDM5) ; off-sheet H1_P5_TX_P
H1_P6_D_N: U1.41(USB2DN_DM6/PRT_DIS_M6) ; off-sheet H1_P6_D_N
H1_P6_D_P: U1.42(USB2DN_DP6/PRT_DIS_P6) ; off-sheet H1_P6_D_P
H1_PF14: U1.57(PF14) ; off-sheet H1_PF14
H1_PF15: U1.58(PF15) ; off-sheet H1_PF15
H1_PF16: U1.59(PF16) ; off-sheet H1_PF16
H1_PF17: U1.60(PF17) ; off-sheet H1_PF17
H1_UP_D_N: U1.90(USB2UP_DM) ; off-sheet H1_UP_D_N
H1_UP_D_P: U1.89(USB2UP_DP) ; off-sheet H1_UP_D_P
H1_UP_RX_N: U1.95(USB3UP_RXDM) ; off-sheet H1_UP_RX_N
H1_UP_RX_P: U1.94(USB3UP_RXDP) ; off-sheet H1_UP_RX_P
H1_UP_TX_N: U1.92(USB3UP_TXDM) ; off-sheet H1_UP_TX_N
H1_UP_TX_P: U1.91(USB3UP_TXDP) ; off-sheet H1_UP_TX_P
H2_1: J1.6 R8.1 R9.2
RESET_N1: C24.2 R16.2 SW1.1 SW1.2 U1.1(RESET_N) U3.2(*RESET) U4.2(A)
SPI1_CE: J1.4 U2.1(~{CE}) U5.2(A)
SPI1_CE_N/CFG_NON_REM/PF20: J1.5 U1.69(SPI_CE_N/CFG_NON_REM/PF20) ; off-sheet SPI1_CE_N/CFG_NON_REM/PF20
SPI1_CLK: J2.4 R20.1 U1.68(SPI_CLK/PF21) U2.6(SCK) ; off-sheet SPI1_CLK/PF21  [also labelled SPI1_CLK/PF21]
SPI1_D2: J2.1 R22.2
SPI1_D3: J2.3 R24.2
SPI1_MISO/D1: R21.1 U1.71(SPI_D1MISO/PF23) U2.2(SO/SIO1) ; off-sheet SPI1_D1MISO/PF23  [also labelled SPI1_D1MISO/PF23]
SPI1_MOSI/D0: J1.1 J2.2 U2.5(SI/SIO0)
SPI1_MOSI/D0/CFG_BC_EN/PF22: J1.2 U1.70(SPI_MOSI/D0/CFG_BC_EN/PF22) ; off-sheet SPI1_MOSI/D0/CFG_BC_EN/PF22
XXTAL1: C21.1 U1.97(XXTALO) Y2.3
NetD1_A: D1.A R17.1
NetD2_A: D2.A R23.1
NetJ3_1: J3.1 R18.1 R24.1 U2.7(~{HOLD}/SIO3)
NetR1_1: R1.1 Y1.3(OUT)
NetR2_1: R2.1 R3.1 U1.2(PF30/VBUS_MON_UP)
NetR4_1: R4.1 U1.23(CFG_STRAP3)
NetR5_1: R5.1 U1.22(CFG_STRAP2)
NetR6_1: R6.1 U1.21(CFG_STRAP1)
NetR7_2: R7.2 U1.24(TESTEN)
NetR11_2: R11.2 U1.100(RBIAS)
NetR13_1: R13.1 U1.63(TEST1)
NetR14_1: R14.1 U1.64(TEST2)
NetR15_1: R15.1 U1.65(TEST3)
NetR17_2: R17.2 U4.4(~{Y})
NetR19_1: R19.1 R22.1 U2.3(~{WP}/SIO2)
NetR23_2: R23.2 U5.4(~{Y})
NetTP1_1: TP1.1 U1.96(ATEST)

Not connected (* = marked no-connect by the designer): U1 4(NC)* 12(NC)* 13(NC)* 44(PF3)* 45(PF4)* 46(PF5)* 47(PF6)* 48(PF7)* 49(PF8)* 50(PF9)* 51(PF10)* 52(PF11)* 54(PF12)* 56(PF13)* 66(PF19)* 72(SPI_D2/PF24)* 73(SPI_D3/PF25)* 74(PF29)* 75(PF26)* 76(PF27)* 77(PF28)* 80(NC)*

### Layout directives
differential pair; differential pair class Diff_90R: H1_P1_D_N, H1_P1_D_P, H1_P1_RX_N, H1_P1_RX_P, H1_P1_TX_N, H1_P1_TX_P, H1_P2_D_N, H1_P2_D_P, H1_P2_RX_N, H1_P2_RX_P, H1_P2_TX_N, H1_P2_TX_P, H1_P3_D_N, H1_P3_D_P, H1_P3_RX_N, H1_P3_RX_P, H1_P3_TX_N, H1_P3_TX_P, H1_P4_D_N, H1_P4_D_P, H1_P4_RX_N, H1_P4_RX_P, H1_P4_TX_N, H1_P4_TX_P, H1_P5_D_N, H1_P5_D_P, H1_P5_RX_N, H1_P5_RX_P, H1_P5_TX_N, H1_P5_TX_P, H1_P6_D_N, H1_P6_D_P, H1_UP_D_N, H1_UP_D_P, H1_UP_RX_N, H1_UP_RX_P, H1_UP_TX_N, H1_UP_TX_P

### Notes on the sheet
- USB3.1 Hub 1
- All Ports REM
- No Ports BC EN
- (in symbol Title_Block) This document is sole property of ENDEVSYSTEMS inc. As confidential, reproduction, conveyance or information to third parties and other unauthorized use are not permited except in exact accordance with prior express permission.; Project:; Sheet Title:; Revision:; Date:; Sheet; of

### Library data of the parts
C1-C19 C22-C25 = Cap: Capacitor; Published: 8-Jun-2000; LatestRevisionDate: 17-Jul-2002; LatestRevisionNote: Re-released for DXP Platform.; PackageReference: RAD-0.3; Publisher: Altium Limited; PackageDescription: Radial Cap, Thru-Hole; 2 Leads; 0.3 in Pin Spacing
  C1-C14 C16-C19 C22 C23 C25: Value: 0.1uF
  C15: Value: 10uF
C20 C21 = Cap: Capacitor; Value: 0.1uF; Published: 8-Jun-2000; LatestRevisionDate: 17-Jul-2002; LatestRevisionNote: Re-released for DXP Platform.; PackageReference: RAD-0.3; Publisher: Altium Limited; PackageDescription: Radial Cap, Thru-Hole; 2 Leads; 0.3 in Pin Spacing
D1 D2 = Diode-LED: Supplier: Digikey Electronics
J1 = TSW-102-07-G-T: No Description Available; Mfr_Name: Samtec Inc; Copyright: Copyright (C) 2023 Ultra Librarian. All rights reserved.; Manufacturer_Part_Number: TSW-102-07-G-T; Digi-Key_Part_Number_1: TSW-102-07-G-T-ND; RefDes: RefDes; Type: DEV
J2 = Header 2x2: FIXED IND 22UH 620MA 350 MOHM; Mfr. Part No.: PH2-04-UA; Unit Price (USD): 0.1; Supplier Part No.: 2057-PH2-04-UA-ND; Supplier: Digikey Electronics
J3 = Header 1x2: as J36 on sheet USBC-US-Conn; Supplier Part No.: 609-75160-156-03LF-ND; Supplier: Digikey Electronics
R1 R22 R24 = Res1: Resistor; Value: 200K; Published: 8-Jun-2000; LatestRevisionDate: 17-Jul-2002; LatestRevisionNote: Re-released for DXP Platform.; PackageReference: AXIAL-0.3; Publisher: Altium Limited; PackageDescription: Axial Device, Thru-Hole; 2 Leads; 0.3 in Pin Spacing
R2 R3 R8-R12 R16 R17 R20 R21 R23 = Res1: Resistor; Value: 10K; Published: 8-Jun-2000; LatestRevisionDate: 17-Jul-2002; LatestRevisionNote: Re-released for DXP Platform.; PackageReference: AXIAL-0.3; Publisher: Altium Limited; PackageDescription: Axial Device, Thru-Hole; 2 Leads; 0.3 in Pin Spacing
R4-R7 R13-R15 R18 R19 R86 R87 = Res1: Resistor; Published: 8-Jun-2000; LatestRevisionDate: 17-Jul-2002; LatestRevisionNote: Re-released for DXP Platform.; PackageReference: AXIAL-0.3; Publisher: Altium Limited; PackageDescription: Axial Device, Thru-Hole; 2 Leads; 0.3 in Pin Spacing
  R4 R5: Value: 200K
  R6 R7 R13-R15 R18 R19 R86 R87: Value: 10K
SW1 = PTS810_SJM_250_SMTR_LFS: Tactile Switch SPST-NO Top Actuated Surface Mount; MF: C&K; MP: PTS810 SJM 250 SMTR LFS; Price: None; Package: None; Availability: Unavailable; Value: *; SnapEDA_Link: https://www.snapeda.com/parts/PTS810%20SJM%20250%20SMTR%20LFS/C%26K/view-part/522770/?ref=snap
U1 = USB7206: IC USB3.1 GEN2 HUB TYPE C; Manufacturer: Microchip Technology; Manufacturer Product Number: USB7206CT-I/KDX; Digi-Key Part Number: 150-USB7206CT-I/KDXTR-ND; Unit Price: $12.9; Stock: 4935
U3 = MIC803-29D4VM3-TR: No Description Available; Mfr_Name: Microchip; Copyright: Copyright (C) 2023 Ultra Librarian. All rights reserved.; Manufacturer_Part_Number: MIC803-29D4VM3-TR; Digi-Key_Part_Number_1: 576-3806-1-ND; Digi-Key_Part_Number_2: 576-3806-2-ND; Digi-Key_Part_Number_3: 576-3806-6-ND; RefDes: RefDes; Type: DEV
U4 U5 = 74LVC1G14GW,125: as U49 on sheet USBC-US-Conn; Price: None; Availability: Unavailable; MP: 74LVC1G14GW,125; Value: *; Package: None
Y1 = DSC1001CI2-025.0000: No Description Available; Mfr_Name: Microchip; Copyright: Copyright (C) 2023 Ultra Librarian. All rights reserved.; Manufacturer_Part_Number: DSC1001CI2-025.0000; Digi-Key_Part_Number_1: 576-4957-5-ND; RefDes: RefDes; Type: DEV
Y2 = ECS-250-10-37B2-CKM-TR: Parameter 1: ECS-250-10-37B2-CKM-TR
?#3 = Title_Block: Date:: *

## Sheet USBC_Hub2.SchDoc
size A3; SheetNumber: 1; SheetTotal: 4
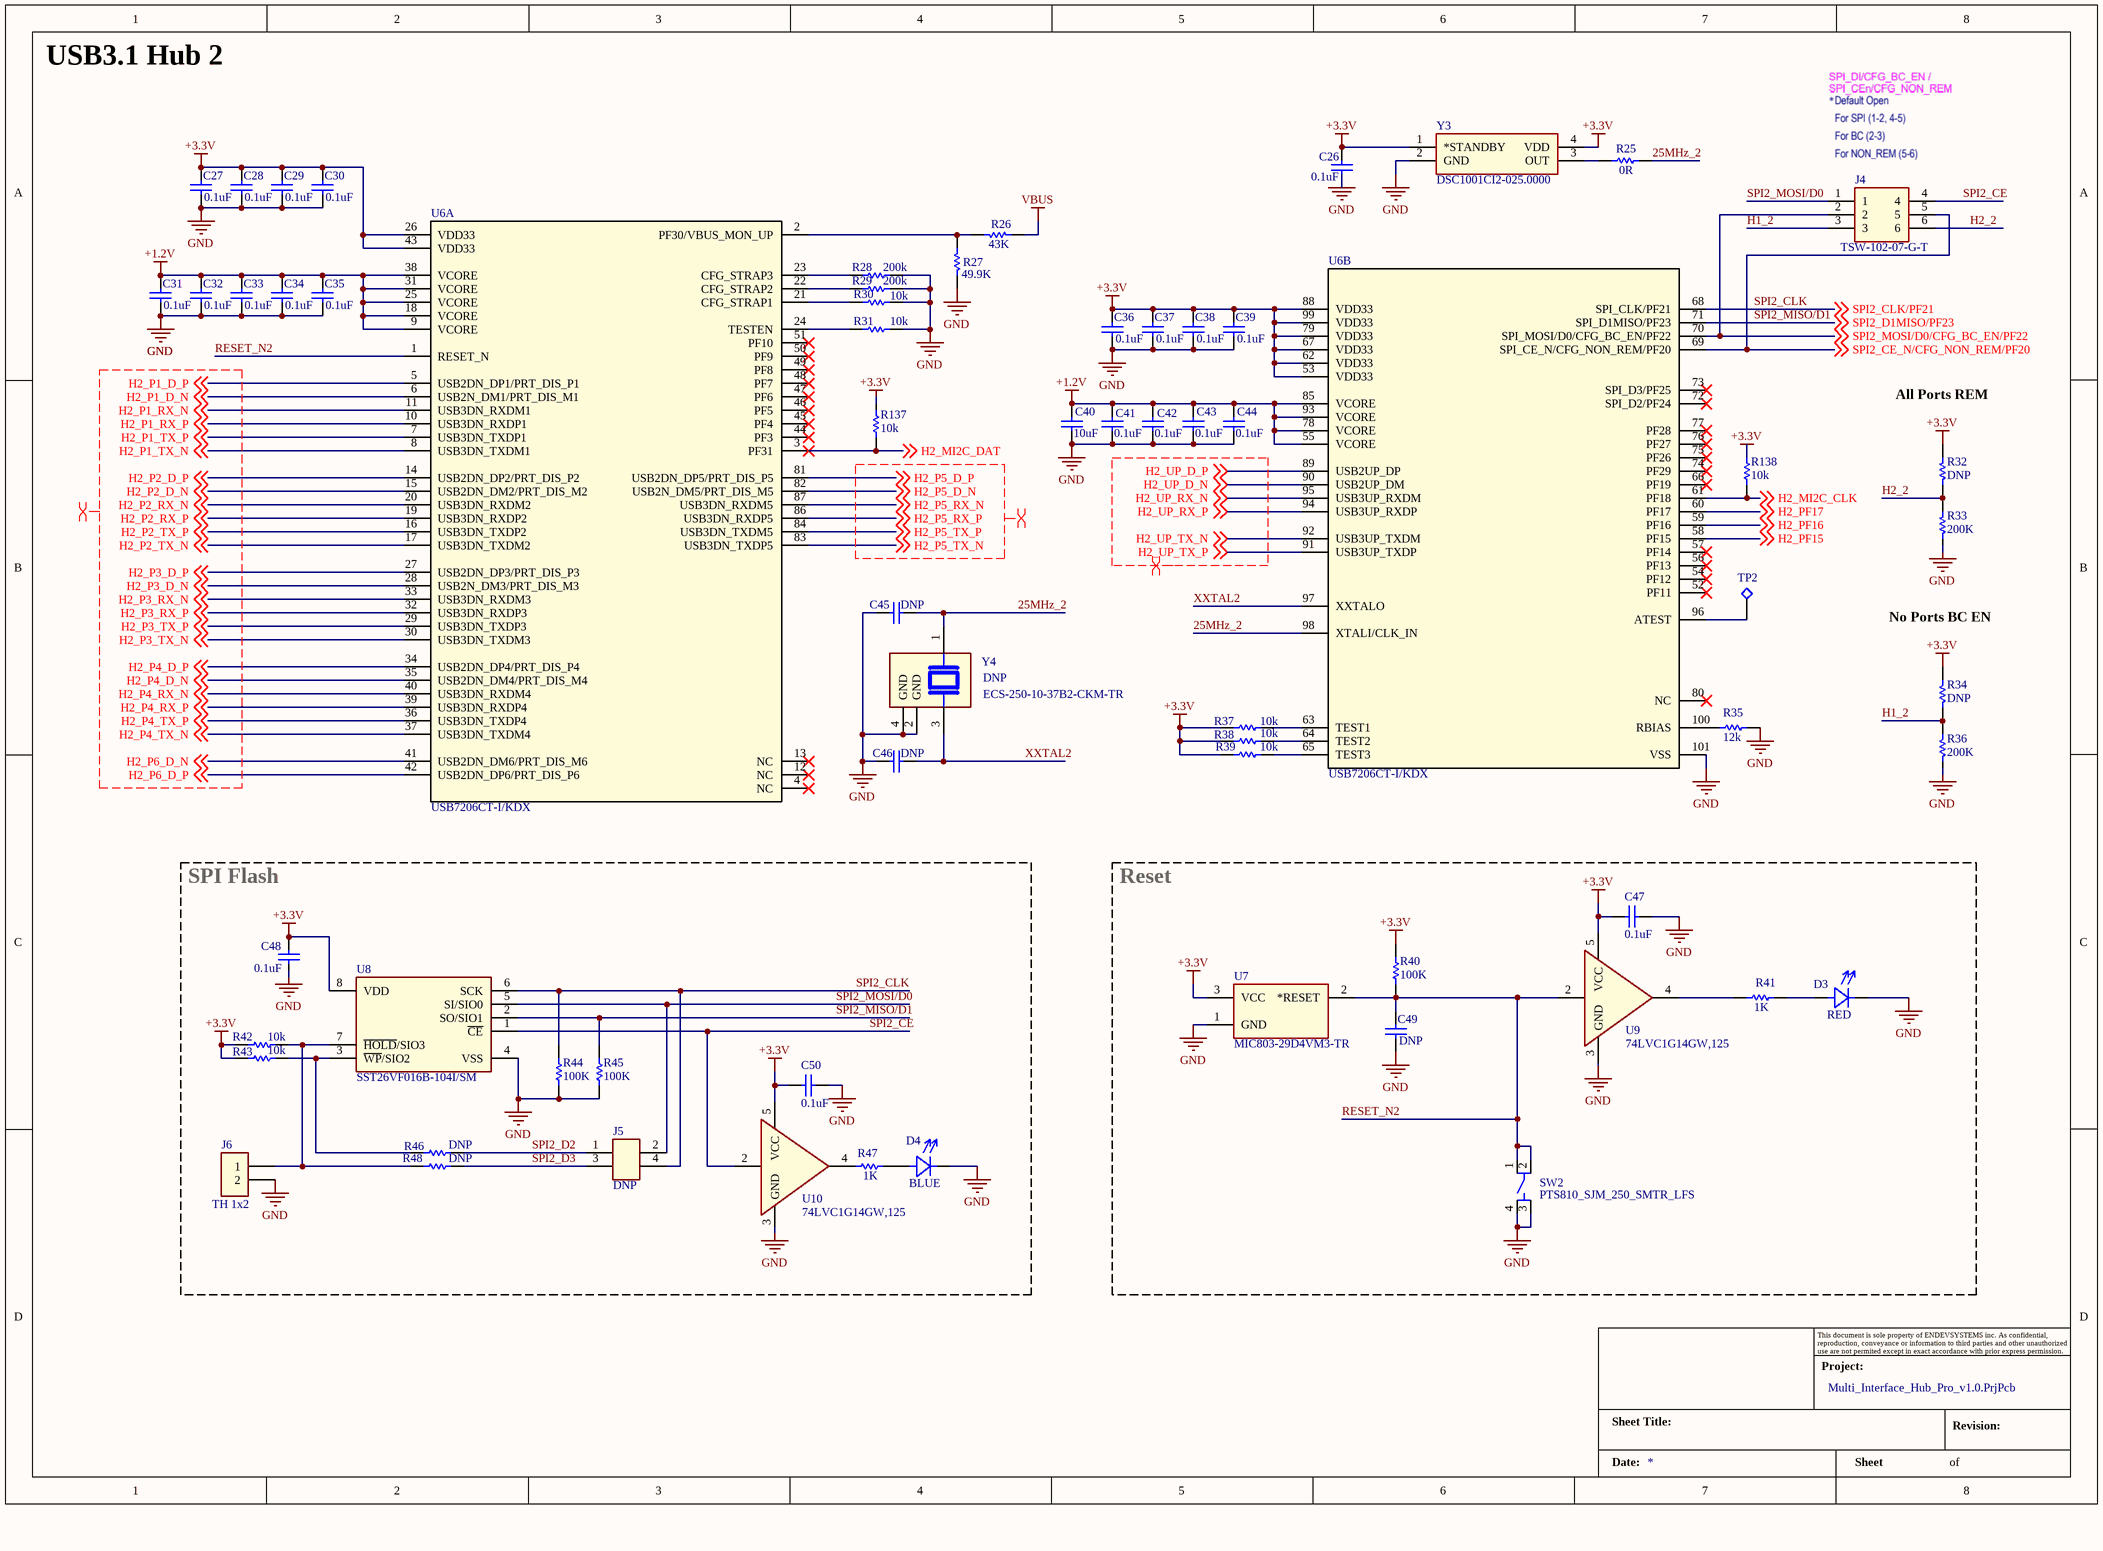
[diagram p3: USBC_Hub2.SchDoc]

### Parts
(Parts that share a designator on the sheet are numbered #1, #2 ... from top to bottom, then left to right.)
?#4  Project:: Multi_Interface_Hub_Pro_v1.0.PrjPcb  (hidden comment: Title_Block)  (graphical)
C26  0.1uF  [C-0402/1005]
C27  0.1uF  [C-0402/1005]
C28  0.1uF  [C-0402/1005]
C29  0.1uF  [C-0402/1005]
C30  0.1uF  [C-0402/1005]
C31  0.1uF  [C-0402/1005]
C32  0.1uF  [C-0402/1005]
C33  0.1uF  [C-0402/1005]
C34  0.1uF  [C-0402/1005]
C35  0.1uF  [C-0402/1005]
C36  0.1uF  [C-0402/1005]
C37  0.1uF  [C-0402/1005]
C38  0.1uF  [C-0402/1005]
C39  0.1uF  [C-0402/1005]
C40  10uF  [C-0805/2012]
C41  0.1uF  [C-0402/1005]
C42  0.1uF  [C-0402/1005]
C43  0.1uF  [C-0402/1005]
C44  0.1uF  [C-0402/1005]
C45  DNP  [R-0402/1005]
C46  DNP  [R-0402/1005]
C47  0.1uF  [C-0402/1005]
C48  0.1uF  [C-0402/1005]
C49  value DNP  [C-0402/1005]  (hidden comment: 0.1uF)
C50  0.1uF  [C-0402/1005]
D3  RED  [LEDC1608X65N]
D4  BLUE  [LEDC1608X65N]
J4  TSW-102-07-G-T  [CON6_3X2_TU_TSW_SAI]
J5  DNP  [PIN HEADER 2x2 2.54mm]
J6  TH 1x2  [PIN HEADER 1x2 2.54mm]
R25  0R  [R-0402/1005]
R26  43K  [R-0402/1005]
R27  49.9K  [R-0402/1005]
R28  200k  [R-0402/1005]
R29  200k  [R-0402/1005]
R30  10k  [R-0402/1005]
R31  10k  [R-0402/1005]
R32  DNP  [R-0402/1005]
R33  200K  [R-0402/1005]
R34  DNP  [R-0402/1005]
R35  12k  [R-0402/1005]
R36  200K  [R-0402/1005]
R37  10k  [R-0402/1005]
R38  10k  [R-0402/1005]
R39  10k  [R-0402/1005]
R40  100K  [R-0402/1005]
R41  1K  [R-0402/1005]
R42  10k  [R-0402/1005]
R43  10k  [R-0402/1005]
R44  100K  [R-0402/1005]
R45  100K  [R-0402/1005]
R46  DNP  [R-0402/1005]
R47  1K  [R-0402/1005]
R48  DNP  [R-0402/1005]
R137  10k  [R-0402/1005]
R138  10k  [R-0402/1005]
SW2  PTS810_SJM_250_SMTR_LFS  [SW_PTS810_SJM_250_SMTR_LFS]
TP2  Test Points  [Test Point TH Round H0.9,D1.6]  (value not drawn)
U6  USB7206CT-I/KDX  [USB7206]  (parts A,B of 2)
U7  MIC803-29D4VM3-TR  [SOT-23_M3_MCH]
U8  SST26VF016B-104I/SM  [SOIC127P794X203-8N]
U9  74LVC1G14GW,125  [SOT65P212X110-5N]
U10  74LVC1G14GW,125  [SOT65P212X110-5N]
Y3  DSC1001CI2-025.0000  [CDFN4_3P2X2P5_MCH]
Y4  DNP  [ECS-250-10-37B2]

### Blocks framed on the sheet
SPI Flash: C48 C50 D4 J5 J6 R42-R48 U8 U10
Reset: C47 C49 D3 R40 R41 SW2 U7 U9

### Nets
+1.2V: C31.2 C32.2 C33.2 C34.2 C35.2 C40.2 C41.1 C42.1 C43.2 C44.2 U6.9(VCORE) U6.18(VCORE) U6.25(VCORE) U6.31(VCORE) U6.38(VCORE) U6.55(VCORE) U6.78(VCORE) U6.85(VCORE) U6.93(VCORE)
+3.3V: C26.2 C27.2 C28.2 C29.2 C30.2 C36.2 C37.2 C38.2 C39.2 C47.2 C48.2 C50.2 R32.2 R34.2 R37.2 R38.2 R39.2 R40.1 R42.2 R43.2 R137.1 R138.1 U6.26(VDD33) U6.43(VDD33) U6.53(VDD33) U6.62(VDD33) U6.67(VDD33) U6.79(VDD33) U6.88(VDD33) U6.99(VDD33) U7.3(VCC) U8.8(VDD) U9.5(VCC) U10.5(VCC) Y3.1(*STANDBY) Y3.4(VDD)
GND: C26.1 C27.1 C28.1 C29.1 C30.1 C31.1 C32.1 C33.1 C34.1 C35.1 C36.1 C37.1 C38.1 C39.1 C40.1 C41.2 C42.2 C43.1 C44.1 C45.2 C46.2 C47.1 C48.1 C49.1 C50.1 D3.C D4.C J6.2 R27.2 R28.2 R29.2 R30.2 R31.1 R33.1 R35.1 R36.1 R44.2 R45.2 SW2.3 SW2.4 U6.101(VSS) U7.1(GND) U8.4(VSS) U9.3(GND) U10.3(GND) Y3.2(GND) Y4.2(GND) Y4.4(GND)
VBUS: R26.2
25MHz_2: C45.1 R25.2 U6.98(XTALI/CLK_IN) Y4.1
H1_2: J4.3 R34.1 R36.2
H2_2: J4.6 R32.1 R33.2
H2_MI2C_CLK: R138.2 U6.61(PF18) ; off-sheet H2_MI2C_CLK
H2_MI2C_DAT: R137.2 U6.3(PF31) ; off-sheet H2_MI2C_DAT
H2_P1_D_N: U6.6(USB2N_DM1/PRT_DIS_M1) ; off-sheet H2_P1_D_N
H2_P1_D_P: U6.5(USB2DN_DP1/PRT_DIS_P1) ; off-sheet H2_P1_D_P
H2_P1_RX_N: U6.11(USB3DN_RXDM1) ; off-sheet H2_P1_RX_N
H2_P1_RX_P: U6.10(USB3DN_RXDP1) ; off-sheet H2_P1_RX_P
H2_P1_TX_N: U6.8(USB3DN_TXDM1) ; off-sheet H2_P1_TX_N
H2_P1_TX_P: U6.7(USB3DN_TXDP1) ; off-sheet H2_P1_TX_P
H2_P2_D_N: U6.15(USB2DN_DM2/PRT_DIS_M2) ; off-sheet H2_P2_D_N
H2_P2_D_P: U6.14(USB2DN_DP2/PRT_DIS_P2) ; off-sheet H2_P2_D_P
H2_P2_RX_N: U6.20(USB3DN_RXDM2) ; off-sheet H2_P2_RX_N
H2_P2_RX_P: U6.19(USB3DN_RXDP2) ; off-sheet H2_P2_RX_P
H2_P2_TX_N: U6.17(USB3DN_TXDM2) ; off-sheet H2_P2_TX_N
H2_P2_TX_P: U6.16(USB3DN_TXDP2) ; off-sheet H2_P2_TX_P
H2_P3_D_N: U6.28(USB2N_DM3/PRT_DIS_M3) ; off-sheet H2_P3_D_N
H2_P3_D_P: U6.27(USB2DN_DP3/PRT_DIS_P3) ; off-sheet H2_P3_D_P
H2_P3_RX_N: U6.33(USB3DN_RXDM3) ; off-sheet H2_P3_RX_N
H2_P3_RX_P: U6.32(USB3DN_RXDP3) ; off-sheet H2_P3_RX_P
H2_P3_TX_N: U6.30(USB3DN_TXDM3) ; off-sheet H2_P3_TX_N
H2_P3_TX_P: U6.29(USB3DN_TXDP3) ; off-sheet H2_P3_TX_P
H2_P4_D_N: U6.35(USB2DN_DM4/PRT_DIS_M4) ; off-sheet H2_P4_D_N
H2_P4_D_P: U6.34(USB2DN_DP4/PRT_DIS_P4) ; off-sheet H2_P4_D_P
H2_P4_RX_N: U6.40(USB3DN_RXDM4) ; off-sheet H2_P4_RX_N
H2_P4_RX_P: U6.39(USB3DN_RXDP4) ; off-sheet H2_P4_RX_P
H2_P4_TX_N: U6.37(USB3DN_TXDM4) ; off-sheet H2_P4_TX_N
H2_P4_TX_P: U6.36(USB3DN_TXDP4) ; off-sheet H2_P4_TX_P
H2_P5_D_N: U6.82(USB2N_DM5/PRT_DIS_M5) ; off-sheet H2_P5_D_N
H2_P5_D_P: U6.81(USB2DN_DP5/PRT_DIS_P5) ; off-sheet H2_P5_D_P
H2_P5_RX_N: U6.87(USB3DN_RXDM5) ; off-sheet H2_P5_RX_N
H2_P5_RX_P: U6.86(USB3DN_RXDP5) ; off-sheet H2_P5_RX_P
H2_P5_TX_N: U6.83(USB3DN_TXDP5) ; off-sheet H2_P5_TX_N
H2_P5_TX_P: U6.84(USB3DN_TXDM5) ; off-sheet H2_P5_TX_P
H2_P6_D_N: U6.41(USB2DN_DM6/PRT_DIS_M6) ; off-sheet H2_P6_D_N
H2_P6_D_P: U6.42(USB2DN_DP6/PRT_DIS_P6) ; off-sheet H2_P6_D_P
H2_PF15: U6.58(PF15) ; off-sheet H2_PF15
H2_PF16: U6.59(PF16) ; off-sheet H2_PF16
H2_PF17: U6.60(PF17) ; off-sheet H2_PF17
H2_UP_D_N: U6.90(USB2UP_DM) ; off-sheet H2_UP_D_N
H2_UP_D_P: U6.89(USB2UP_DP) ; off-sheet H2_UP_D_P
H2_UP_RX_N: U6.95(USB3UP_RXDM) ; off-sheet H2_UP_RX_N
H2_UP_RX_P: U6.94(USB3UP_RXDP) ; off-sheet H2_UP_RX_P
H2_UP_TX_N: U6.92(USB3UP_TXDM) ; off-sheet H2_UP_TX_N
H2_UP_TX_P: U6.91(USB3UP_TXDP) ; off-sheet H2_UP_TX_P
RESET_N2: C49.2 R40.2 SW2.1 SW2.2 U6.1(RESET_N) U7.2(*RESET) U9.2(A)
SPI2_CE: J4.4 U8.1(~{CE}) U10.2(A)
SPI2_CE_N/CFG_NON_REM/PF20: J4.5 U6.69(SPI_CE_N/CFG_NON_REM/PF20) ; off-sheet SPI2_CE_N/CFG_NON_REM/PF20
SPI2_CLK: J5.4 R44.1 U6.68(SPI_CLK/PF21) U8.6(SCK) ; off-sheet SPI2_CLK/PF21  [also labelled SPI2_CLK/PF21]
SPI2_D2: J5.1 R46.2
SPI2_D3: J5.3 R48.2
SPI2_MISO/D1: R45.1 U6.71(SPI_D1MISO/PF23) U8.2(SO/SIO1) ; off-sheet SPI2_D1MISO/PF23  [also labelled SPI2_D1MISO/PF23]
SPI2_MOSI/D0: J4.1 J5.2 U8.5(SI/SIO0)
SPI2_MOSI/D0/CFG_BC_EN/PF22: J4.2 U6.70(SPI_MOSI/D0/CFG_BC_EN/PF22) ; off-sheet SPI2_MOSI/D0/CFG_BC_EN/PF22
XXTAL2: C46.1 U6.97(XXTALO) Y4.3
NetD3_A: D3.A R41.1
NetD4_A: D4.A R47.1
NetJ6_1: J6.1 R42.1 R48.1 U8.7(~{HOLD}/SIO3)
NetR25_1: R25.1 Y3.3(OUT)
NetR26_1: R26.1 R27.1 U6.2(PF30/VBUS_MON_UP)
NetR28_1: R28.1 U6.23(CFG_STRAP3)
NetR29_1: R29.1 U6.22(CFG_STRAP2)
NetR30_1: R30.1 U6.21(CFG_STRAP1)
NetR31_2: R31.2 U6.24(TESTEN)
NetR35_2: R35.2 U6.100(RBIAS)
NetR37_1: R37.1 U6.63(TEST1)
NetR38_1: R38.1 U6.64(TEST2)
NetR39_1: R39.1 U6.65(TEST3)
NetR41_2: R41.2 U9.4(~{Y})
NetR43_1: R43.1 R46.1 U8.3(~{WP}/SIO2)
NetTP2_1: TP2.1 U6.96(ATEST)

Not connected (* = marked no-connect by the designer): R47 2; U6 4(NC)* 12(NC)* 13(NC)* 44(PF3)* 45(PF4)* 46(PF5)* 47(PF6)* 48(PF7)* 49(PF8)* 50(PF9)* 51(PF10)* 52(PF11)* 54(PF12)* 56(PF13)* 57(PF14)* 66(PF19)* 72(SPI_D2/PF24)* 73(SPI_D3/PF25)* 74(PF29)* 75(PF26)* 76(PF27)* 77(PF28)* 80(NC)*; U10 4(~{Y})

### Layout directives
differential pair; differential pair class Diff_90R: H2_P1_D_N, H2_P1_D_P, H2_P1_RX_N, H2_P1_RX_P, H2_P1_TX_N, H2_P1_TX_P, H2_P2_D_N, H2_P2_D_P, H2_P2_RX_N, H2_P2_RX_P, H2_P2_TX_N, H2_P2_TX_P, H2_P3_D_N, H2_P3_D_P, H2_P3_RX_N, H2_P3_RX_P, H2_P3_TX_N, H2_P3_TX_P, H2_P4_D_N, H2_P4_D_P, H2_P4_RX_N, H2_P4_RX_P, H2_P4_TX_N, H2_P4_TX_P, H2_P5_D_N, H2_P5_D_P, H2_P5_RX_N, H2_P5_RX_P, H2_P5_TX_N, H2_P5_TX_P, H2_P6_D_N, H2_P6_D_P, H2_UP_D_N, H2_UP_D_P, H2_UP_RX_N, H2_UP_RX_P, H2_UP_TX_N, H2_UP_TX_P

### Notes on the sheet
- USB3.1 Hub 2
- All Ports REM
- No Ports BC EN
- (in symbol Title_Block) This document is sole property of ENDEVSYSTEMS inc. As confidential, reproduction, conveyance or information to third parties and other unauthorized use are not permited except in exact accordance with prior express permission.; Project:; Sheet Title:; Revision:; Date:; Sheet; of

### Library data of the parts
C26-C44 C47-C50 = Cap: Capacitor; Published: 8-Jun-2000; LatestRevisionDate: 17-Jul-2002; LatestRevisionNote: Re-released for DXP Platform.; PackageReference: RAD-0.3; Publisher: Altium Limited; PackageDescription: Radial Cap, Thru-Hole; 2 Leads; 0.3 in Pin Spacing
  C26-C39 C41-C44 C47 C48 C50: Value: 0.1uF
  C40: Value: 10uF
C45 C46 = Cap: Capacitor; Value: 0.1uF; Published: 8-Jun-2000; LatestRevisionDate: 17-Jul-2002; LatestRevisionNote: Re-released for DXP Platform.; PackageReference: RAD-0.3; Publisher: Altium Limited; PackageDescription: Radial Cap, Thru-Hole; 2 Leads; 0.3 in Pin Spacing
D3 D4 = Diode-LED: Supplier: Digikey Electronics
J4 = TSW-102-07-G-T: as J1 on sheet USBC_Hub1; Copyright: Copyright (C) 2023 Ultra Librarian. All rights reserved.; Manufacturer_Part_Number: TSW-102-07-G-T; Digi-Key_Part_Number_1: TSW-102-07-G-T-ND; RefDes: RefDes; Type: DEV
J5 = Header 2x2: as J2 on sheet USBC_Hub1; Supplier Part No.: 2057-PH2-04-UA-ND; Supplier: Digikey Electronics
J6 = Header 1x2: as J36 on sheet USBC-US-Conn; Supplier Part No.: 609-75160-156-03LF-ND; Supplier: Digikey Electronics
R25 R46 R48 = Res1: Resistor; Value: 200K; Published: 8-Jun-2000; LatestRevisionDate: 17-Jul-2002; LatestRevisionNote: Re-released for DXP Platform.; PackageReference: AXIAL-0.3; Publisher: Altium Limited; PackageDescription: Axial Device, Thru-Hole; 2 Leads; 0.3 in Pin Spacing
R26 R27 R32-R36 R40 R41 R44 R45 R47 = Res1: Resistor; Value: 10K; Published: 8-Jun-2000; LatestRevisionDate: 17-Jul-2002; LatestRevisionNote: Re-released for DXP Platform.; PackageReference: AXIAL-0.3; Publisher: Altium Limited; PackageDescription: Axial Device, Thru-Hole; 2 Leads; 0.3 in Pin Spacing
R28-R31 R37-R39 R42 R43 R137 R138 = Res1: Resistor; Published: 8-Jun-2000; LatestRevisionDate: 17-Jul-2002; LatestRevisionNote: Re-released for DXP Platform.; PackageReference: AXIAL-0.3; Publisher: Altium Limited; PackageDescription: Axial Device, Thru-Hole; 2 Leads; 0.3 in Pin Spacing
  R28 R29: Value: 200K
  R30 R31 R37-R39 R42 R43 R137 R138: Value: 10K
SW2 = PTS810_SJM_250_SMTR_LFS: as SW1 on sheet USBC_Hub1; Price: None; Package: None; Availability: Unavailable; Value: *; SnapEDA_Link: https://www.snapeda.com/parts/PTS810%20SJM%20250%20SMTR%20LFS/C%26K/view-part/522770/?ref=snap
U6 = USB7206: as U1 on sheet USBC_Hub1; Manufacturer Product Number: USB7206CT-I/KDX; Digi-Key Part Number: 150-USB7206CT-I/KDXTR-ND; Unit Price: $12.9; Stock: 4935
U7 = MIC803-29D4VM3-TR: as U3 on sheet USBC_Hub1; Copyright: Copyright (C) 2023 Ultra Librarian. All rights reserved.; Manufacturer_Part_Number: MIC803-29D4VM3-TR; Digi-Key_Part_Number_1: 576-3806-1-ND; Digi-Key_Part_Number_2: 576-3806-2-ND; Digi-Key_Part_Number_3: 576-3806-6-ND; RefDes: RefDes; Type: DEV
U9 U10 = 74LVC1G14GW,125: as U49 on sheet USBC-US-Conn; Price: None; Availability: Unavailable; MP: 74LVC1G14GW,125; Value: *; Package: None
Y3 = DSC1001CI2-025.0000: as Y1 on sheet USBC_Hub1; Copyright: Copyright (C) 2023 Ultra Librarian. All rights reserved.; Manufacturer_Part_Number: DSC1001CI2-025.0000; Digi-Key_Part_Number_1: 576-4957-5-ND; RefDes: RefDes; Type: DEV
Y4 = ECS-250-10-37B2-CKM-TR: Parameter 1: ECS-250-10-37B2-CKM-TR
?#4 = Title_Block: Date:: *

## Sheet USB2.0_Hub.SchDoc
size A3; SheetNumber: 1; SheetTotal: 4
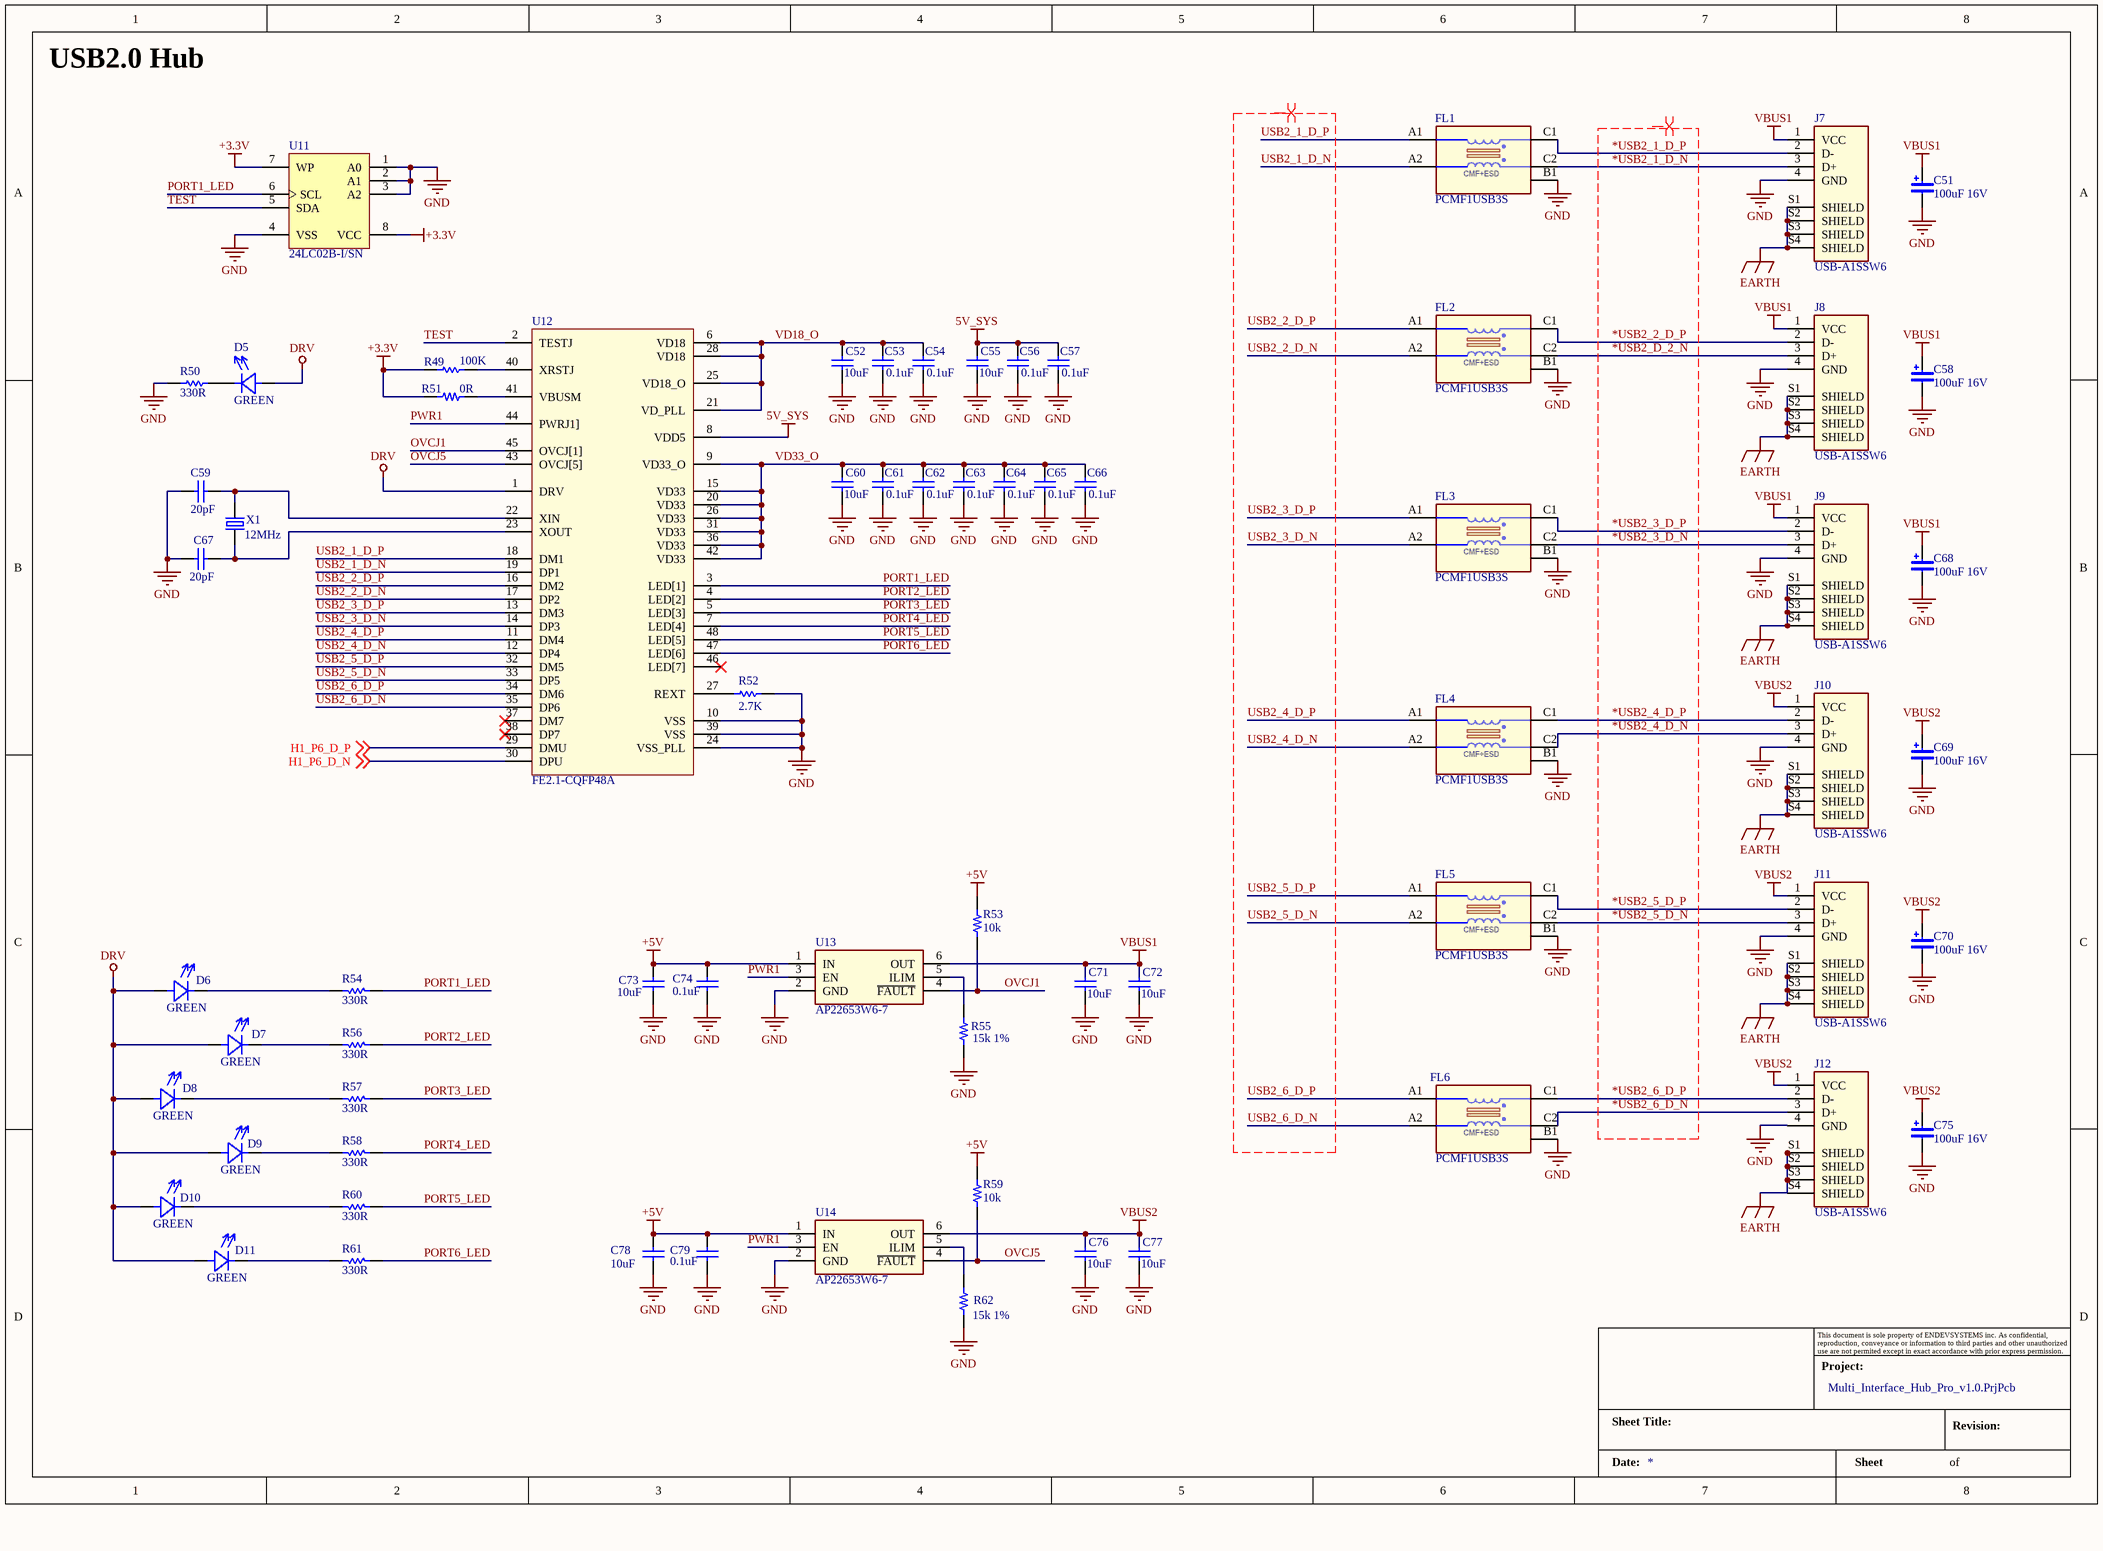
[diagram p4: USB2.0_Hub.SchDoc]

### Parts
(Parts that share a designator on the sheet are numbered #1, #2 ... from top to bottom, then left to right.)
?#5  Project:: Multi_Interface_Hub_Pro_v1.0.PrjPcb  (hidden comment: Title_Block)  (graphical)
C51  100uF 16V  [CAP-TAN-2312]
C52  10uF  [C-0805/2012]
C53  0.1uF  [C-0402/1005]
C54  0.1uF  [C-0402/1005]
C55  10uF  [C-0805/2012]
C56  0.1uF  [C-0402/1005]
C57  0.1uF  [C-0402/1005]
C58  100uF 16V  [CAP-TAN-2312]
C59  20pF  [R-0402/1005]
C60  10uF  [C-0805/2012]
C61  0.1uF  [C-0402/1005]
C62  0.1uF  [C-0402/1005]
C63  0.1uF  [C-0402/1005]
C64  0.1uF  [C-0402/1005]
C65  0.1uF  [C-0402/1005]
C66  0.1uF  [C-0402/1005]
C67  20pF  [R-0402/1005]
C68  100uF 16V  [CAP-TAN-2312]
C69  100uF 16V  [CAP-TAN-2312]
C70  100uF 16V  [CAP-TAN-2312]
C71  10uF  [C-0805/2012]
C72  10uF  [C-0805/2012]
C73  10uF  [C-0805/2012]
C74  0.1uF  [C-0402/1005]
C75  100uF 16V  [CAP-TAN-2312]
C76  10uF  [C-0805/2012]
C77  10uF  [C-0805/2012]
C78  10uF  [C-0805/2012]
C79  0.1uF  [C-0402/1005]
D5  GREEN  [LEDC1608X65N]
D6  GREEN  [LEDC1608X65N]
D7  GREEN  [LEDC1608X65N]
D8  GREEN  [LEDC1608X65N]
D9  GREEN  [LEDC1608X65N]
D10  GREEN  [LEDC1608X65N]
D11  GREEN  [LEDC1608X65N]
FL1  PCMF1USB3S  [WLCSP5(2-1-2)_NEX]
FL2  PCMF1USB3S  [WLCSP5(2-1-2)_NEX]
FL3  PCMF1USB3S  [WLCSP5(2-1-2)_NEX]
FL4  PCMF1USB3S  [WLCSP5(2-1-2)_NEX]
FL5  PCMF1USB3S  [WLCSP5(2-1-2)_NEX]
FL6  PCMF1USB3S  [WLCSP5(2-1-2)_NEX]
J7  USB-A1SSW6  [ONSHORE_USB-A1SSW6]
J8  USB-A1SSW6  [ONSHORE_USB-A1SSW6]
J9  USB-A1SSW6  [ONSHORE_USB-A1SSW6]
J10  USB-A1SSW6  [ONSHORE_USB-A1SSW6]
J11  USB-A1SSW6  [ONSHORE_USB-A1SSW6]
J12  USB-A1SSW6  [ONSHORE_USB-A1SSW6]
R49  100K  [R-0402/1005]
R50  330R  [R-0402/1005]
R51  0R  [R-0402/1005]
R52  value 2.7K  [R-0402/1005]
R53  10k  [R-0402/1005]
R54  330R  [R-0402/1005]
R55  15k 1%  [R-0402/1005]
R56  330R  [R-0402/1005]
R57  330R  [R-0402/1005]
R58  330R  [R-0402/1005]
R59  10k  [R-0402/1005]
R60  330R  [R-0402/1005]
R61  330R  [R-0402/1005]
R62  15k 1%  [R-0402/1005]
U11  24LC02B-I/SN  [SOIC-SN8_N]
U12  FE2.1-CQFP48A  [PCBComponent_1]
U13  AP22653W6-7  [SOT-23-6]
U14  AP22653W6-7  [SOT-23-6]
X1  12MHz  [HC-49/US]

### Nets
5V_SYS: C55.2 C56.2 C57.2 U12.8(VDD5)
+3.3V: R49.1 R51.1 U11.7(WP) U11.8(VCC)
+5V: C73.2 C74.2 C78.2 C79.2 R53.1 R59.1 U13.1(IN) U14.1(IN)
DRV: D5.A D6.A D7.A D8.A D9.A D10.A D11.A U12.1(DRV)
EARTH: J7.S1(SHIELD) J7.S2(SHIELD) J7.S3(SHIELD) J7.S4(SHIELD) J8.S1(SHIELD) J8.S2(SHIELD) J8.S3(SHIELD) J8.S4(SHIELD) J9.S1(SHIELD) J9.S2(SHIELD) J9.S3(SHIELD) J9.S4(SHIELD) J10.S1(SHIELD) J10.S2(SHIELD) J10.S3(SHIELD) J10.S4(SHIELD) J11.S1(SHIELD) J11.S2(SHIELD) J11.S3(SHIELD) J11.S4(SHIELD) J12.S1(SHIELD) J12.S2(SHIELD) J12.S3(SHIELD)
GND: C51.- C52.1 C53.1 C54.1 C55.1 C56.1 C57.1 C58.- C59.2 C60.1 C61.1 C62.1 C63.1 C64.1 C65.1 C66.1 C67.2 C68.- C69.- C70.- C71.1 C72.1 C73.1 C74.1 C75.- C76.1 C77.1 C78.1 C79.1 FL1.B1(GND) FL2.B1(GND) FL3.B1(GND) FL4.B1(GND) FL5.B1(GND) FL6.B1(GND) J7.4(GND) J8.4(GND) J9.4(GND) J10.4(GND) J11.4(GND) R50.1 R52.2 R55.1 R62.1 U11.1(A0) U11.2(A1) U11.3(A2) U11.4(VSS) U12.10(VSS) U12.24(VSS_PLL) U12.39(VSS) U13.2(GND) U14.2(GND)
VBUS1: C51.+ C58.+ C68.+ C71.2 C72.2 J7.1(VCC) J8.1(VCC) J9.1(VCC) U13.6(OUT)
VBUS2: C69.+ C70.+ C75.+ C76.2 C77.2 J10.1(VCC) J11.1(VCC) J12.1(VCC) U14.6(OUT)
*USB2_2_D_P: FL2.C1(CH1_OUT+) J8.2(D-)
*USB2_3_D_N: FL3.C2(CH1_OUT-) J9.3(D+)
*USB2_3_D_P: FL3.C1(CH1_OUT+) J9.2(D-)
*USB2_4_D_N: FL4.C2(CH1_OUT-) J10.3(D+)
*USB2_4_D_P: FL4.C1(CH1_OUT+) J10.2(D-)
*USB2_5_D_N: FL5.C2(CH1_OUT-) J11.3(D+)
*USB2_5_D_P: FL5.C1(CH1_OUT+) J11.2(D-)
*USB2_6_D_N: FL6.C2(CH1_OUT-) J12.3(D+)
*USB2_6_D_P: FL6.C1(CH1_OUT+) J12.2(D-)
*USB2_D_2_N: FL2.C2(CH1_OUT-) J8.3(D+)
H1_P6_D_N: U12.30(DPU) ; off-sheet H1_P6_D_N
H1_P6_D_P: U12.29(DMU) ; off-sheet H1_P6_D_P
OVCJ1: R53.2 U12.45(OVCJ[1]) U13.4(~{FAULT})
OVCJ5: R59.2 U12.43(OVCJ[5]) U14.4(~{FAULT})
PORT1_LED: R54.1 U11.6(SCL) U12.3(LED[1])
PORT2_LED: R56.1 U12.4(LED[2])
PORT3_LED: R57.1 U12.5(LED[3])
PORT4_LED: R58.1 U12.7(LED[4])
PORT5_LED: R60.1 U12.48(LED[5])
PORT6_LED: R61.1 U12.47(LED[6])
PWR1: U12.44(PWRJ1]) U13.3(EN) U14.3(EN)
TEST: U11.5(SDA) U12.2(TESTJ)
USB2_1_D_N: FL1.A2(CH1_IN-) U12.19(DP1)
USB2_1_D_P: FL1.A1(CH1_IN+) U12.18(DM1)
USB2_2_D_N: FL2.A2(CH1_IN-) U12.17(DP2)
USB2_2_D_P: FL2.A1(CH1_IN+) U12.16(DM2)
USB2_3_D_N: FL3.A2(CH1_IN-) U12.14(DP3)
USB2_3_D_P: FL3.A1(CH1_IN+) U12.13(DM3)
USB2_4_D_N: FL4.A2(CH1_IN-) U12.12(DP4)
USB2_4_D_P: FL4.A1(CH1_IN+) U12.11(DM4)
USB2_5_D_N: FL5.A2(CH1_IN-) U12.33(DP5)
USB2_5_D_P: FL5.A1(CH1_IN+) U12.32(DM5)
USB2_6_D_N: FL6.A2(CH1_IN-) U12.35(DP6)
USB2_6_D_P: FL6.A1(CH1_IN+) U12.34(DM6)
VD18_O: C52.2 C53.2 C54.2 U12.6(VD18) U12.21(VD_PLL) U12.25(VD18_O) U12.28(VD18)
VD33_O: C60.2 C61.2 C62.2 C63.2 C64.2 C65.2 C66.2 U12.9(VD33_O) U12.15(VD33) U12.20(VD33) U12.26(VD33) U12.31(VD33) U12.36(VD33) U12.42(VD33)
NetC59_1: C59.1 U12.22(XIN) X1.2
NetC67_1: C67.1 U12.23(XOUT) X1.1
NetD5_C: D5.C R50.2
NetD6_C: D6.C R54.2
NetD7_C: D7.C R56.2
NetD8_C: D8.C R57.2
NetD9_C: D9.C R58.2
NetD10_C: D10.C R60.2
NetD11_C: D11.C R61.2
NetFL1_C1: FL1.C1(CH1_OUT+) J7.2(D-)
NetFL1_C2: FL1.C2(CH1_OUT-) J7.3(D+)
NetR49_2: R49.2 U12.40(XRSTJ)
NetR51_2: R51.2 U12.41(VBUSM)
NetR52_1: R52.1 U12.27(REXT)
NetR55_2: R55.2 U13.5(ILIM)
NetR62_2: R62.2 U14.5(ILIM)

Not connected (* = marked no-connect by the designer): J12 4(GND) S4(SHIELD); U12 37(DM7)* 38(DP7)* 46(LED[7])*

### Layout directives
differential pair; differential pair class Diff_90R: (no net found under the mark), USB2_1_D_N, USB2_1_D_P, USB2_2_D_N, USB2_2_D_P, USB2_3_D_N, USB2_3_D_P, USB2_4_D_N, USB2_4_D_P, USB2_5_D_N, USB2_5_D_P, USB2_6_D_N, USB2_6_D_P

### Notes on the sheet
- USB2.0 Hub
- Labels drawn without touching a wire or pin: *USB2_1_D_N, *USB2_1_D_P
- (in symbol Nexperia, PCMF1USB3SZ) CMF+ESD
- (in symbol Title_Block) This document is sole property of ENDEVSYSTEMS inc. As confidential, reproduction, conveyance or information to third parties and other unauthorized use are not permited except in exact accordance with prior express permission.; Project:; Sheet Title:; Revision:; Date:; Sheet; of

### Library data of the parts
C51 C58 C68-C70 C75 = Capacitor-Polar: as C129 on sheet USBC-US-100W-PD; Supplier Part No.: 478-10723-1-ND; Supplier: Digikey Electronics
C52-C57 C60-C66 C71-C74 C76-C79 = Cap: Capacitor; Published: 8-Jun-2000; LatestRevisionDate: 17-Jul-2002; LatestRevisionNote: Re-released for DXP Platform.; PackageReference: RAD-0.3; Publisher: Altium Limited; PackageDescription: Radial Cap, Thru-Hole; 2 Leads; 0.3 in Pin Spacing
  C52 C55 C60 C71-C73 C76-C78: Value: 10uF
  C53 C54 C56 C57 C61-C66 C74 C79: Value: 0.1uF
C59 C67 = Cap: Capacitor; Value: 0.1uF; Published: 8-Jun-2000; LatestRevisionDate: 17-Jul-2002; LatestRevisionNote: Re-released for DXP Platform.; PackageReference: RAD-0.3; Publisher: Altium Limited; PackageDescription: Radial Cap, Thru-Hole; 2 Leads; 0.3 in Pin Spacing
D5-D11 = Diode-LED: Supplier: Digikey Electronics
FL1-FL6 = Nexperia, PCMF1USB3SZ: FLT, SMT, WLCSP5, Common Mode EMI Filters; Supply Voltage: NO; Notes: NC; Value: PCMF1USB3S; Manufacturer: Nexperia; Mounting: SMT; Operating Temperature: -40ºC ~ +125ºC; Subpart Type: Common Mode EMI Filters; Footprint: WLCSP5; Manufacturer Part Number: PCMF1USB3S; Datasheet Link: https://www.nexperia.com/products/esd-protection-tvs-filtering-and-signal-conditioning/emi-solutions-with-integrated-protection/common-mode-filters-with-integrated-protection/PCMF1USB3S.html; Supply Current: NO; Substitutes Allowed: NO; Height: 0.6mm
J7-J12 = USB-A1SSW6: USB-A (USB TYPE-A) - Receptacle Connector 4 Position Through Hole, Right Angle; MF: On Shore; Value: *; SnapEDA_Link: https://www.snapeda.com/parts/USB-A1SSW6/On+Shore+Technology+Inc./view-part/?ref=snap; Purchase-URL: https://pricing.snapeda.com/search/part/USB-A1SSW6/?ref=eda; Availability: In Stock; Price: None; Package: None; Check_prices: https://www.snapeda.com/parts/USB-A1SSW6/On+Shore+Technology+Inc./view-part/?ref=eda; MP: USB-A1SSW6
R49 R50 R54 R56-R58 R60 R61 = Res1: Resistor; Value: 10K; Published: 8-Jun-2000; LatestRevisionDate: 17-Jul-2002; LatestRevisionNote: Re-released for DXP Platform.; PackageReference: AXIAL-0.3; Publisher: Altium Limited; PackageDescription: Axial Device, Thru-Hole; 2 Leads; 0.3 in Pin Spacing
R51 = Resistor: RES SMD 2.2K OHM 1% 1/16W 0402; Mfr. Part No.: RT0402FRE072K2L; Value: 2.2k 1%; Unit Price (USD): 0.1; Supplier Part No.: 13-RT0402FRE072K2LCT-ND; Supplier: Digikey Electronics
R52 = Res1: Resistor; Published: 8-Jun-2000; LatestRevisionDate: 17-Jul-2002; LatestRevisionNote: Re-released for DXP Platform.; PackageReference: AXIAL-0.3; Publisher: Altium Limited; PackageDescription: Axial Device, Thru-Hole; 2 Leads; 0.3 in Pin Spacing
R53 R59 = Resistor: RES SMD 1K OHM 1% 1/16W 0402; Mfr. Part No.: RC0402FR-071KL; Unit Price (USD): 0.1; Value: 1k; Supplier Part No.: 311-1.00KLRCT-ND; Supplier: Digikey Electronics
R55 R62 = Resistor: RES SMD 15K OHM 1% 1/16W 0402; Mfr. Part No.: MCR01MZPF1502; Unit Price (USD): 0.1; Value: 15k 1%; Supplier Part No.: RHM15.0KLTR-ND; Supplier: Digikey Electronics
U11 = CMP-0159-00332-1: 2Kbit, 400kHz, 2.5V, I2C Serial EEPROM, 8-Pin SOIC 150mil, Industrial Temperature; PackageReference: SOIC-SN8; Code_JEDEC: MS-012; DatasheetVersion: revJ, Feb-2009; Code_IPC: SOIC127P600-8; PackageVersion: revBB, Aug-2009; PackageDescription: 8-Lead Plastic Small Outline (SN) - Narrow, 3.90mm Body [SOIC]
U12 = FE2.1-CQFP48A: LQFP-48(7x7) USB ICs ROHS
U13 U14 = AP22653W6-7: LOAD SWITCH,SOT26,T&R,3K; Unit Price (USD): 0.42; Supplier Part No.: 31-AP22653W6-7CT-ND; Mfr. Part No.: AP22653W6-7; Supplier: Digikey Electronics
X1 = ST3215SB32768C0HPWBB: CRYSTAL 24.0000MHZ 18PF TH; Mfr. Part No.: ECS-240-18-4XEN; Unit Price (USD): 0.66; Supplier: Digikey Electronics; Supplier Part No.: XC1725-ND
?#5 = Title_Block: Date:: *